# EAGLE design microBoard_main (EAGLE 6.2)

## Sheet 1 of 7: Project Environment
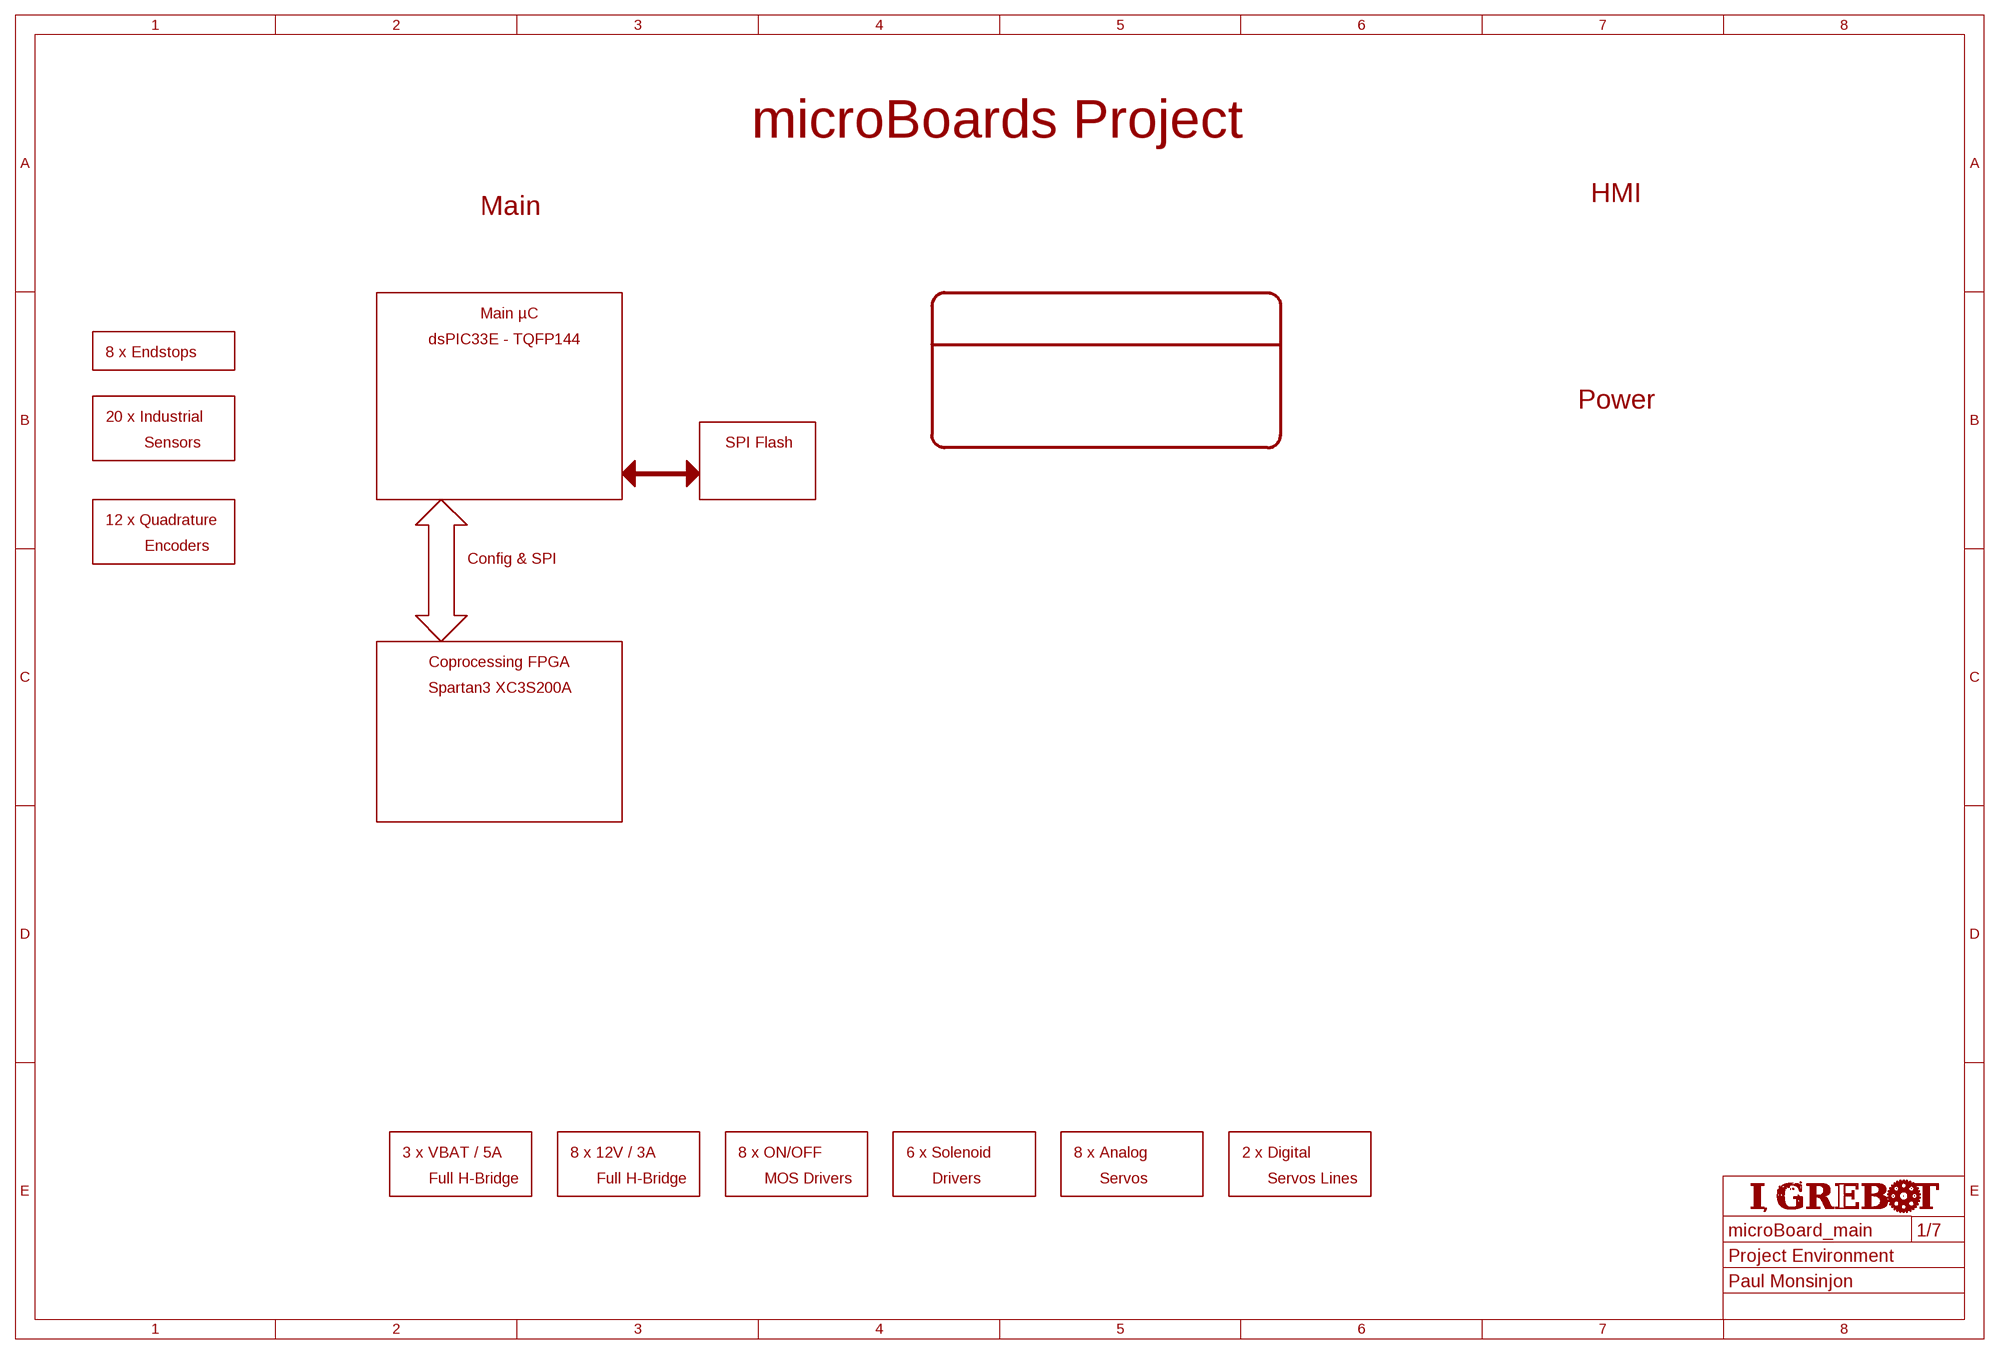
[diagram p0: schematic, sheet 1]
U$7 (FRAME_A3): AUTHOR: Paul Monsinjon; SHEET_NAME: Project Environment

### Notes on the sheet
- microBoards Project
- HMI
- Main
- Main µC
- dsPIC33E - TQFP144
- 8 x Endstops
- Power
- 20 x Industrial
- Sensors | SPI Flash
- 12 x Quadrature
- Encoders
- Config & SPI
- Coprocessing FPGA
- Spartan3 XC3S200A
- 3 x VBAT / 5A | 8 x 12V / 3A | 8 x ON/OFF | 6 x Solenoid | 8 x Analog | 2 x Digital
- Full H-Bridge | Full H-Bridge | MOS Drivers | Drivers | Servos | Servos Lines

## Sheet 2 of 7: Main µC dsPIC33E
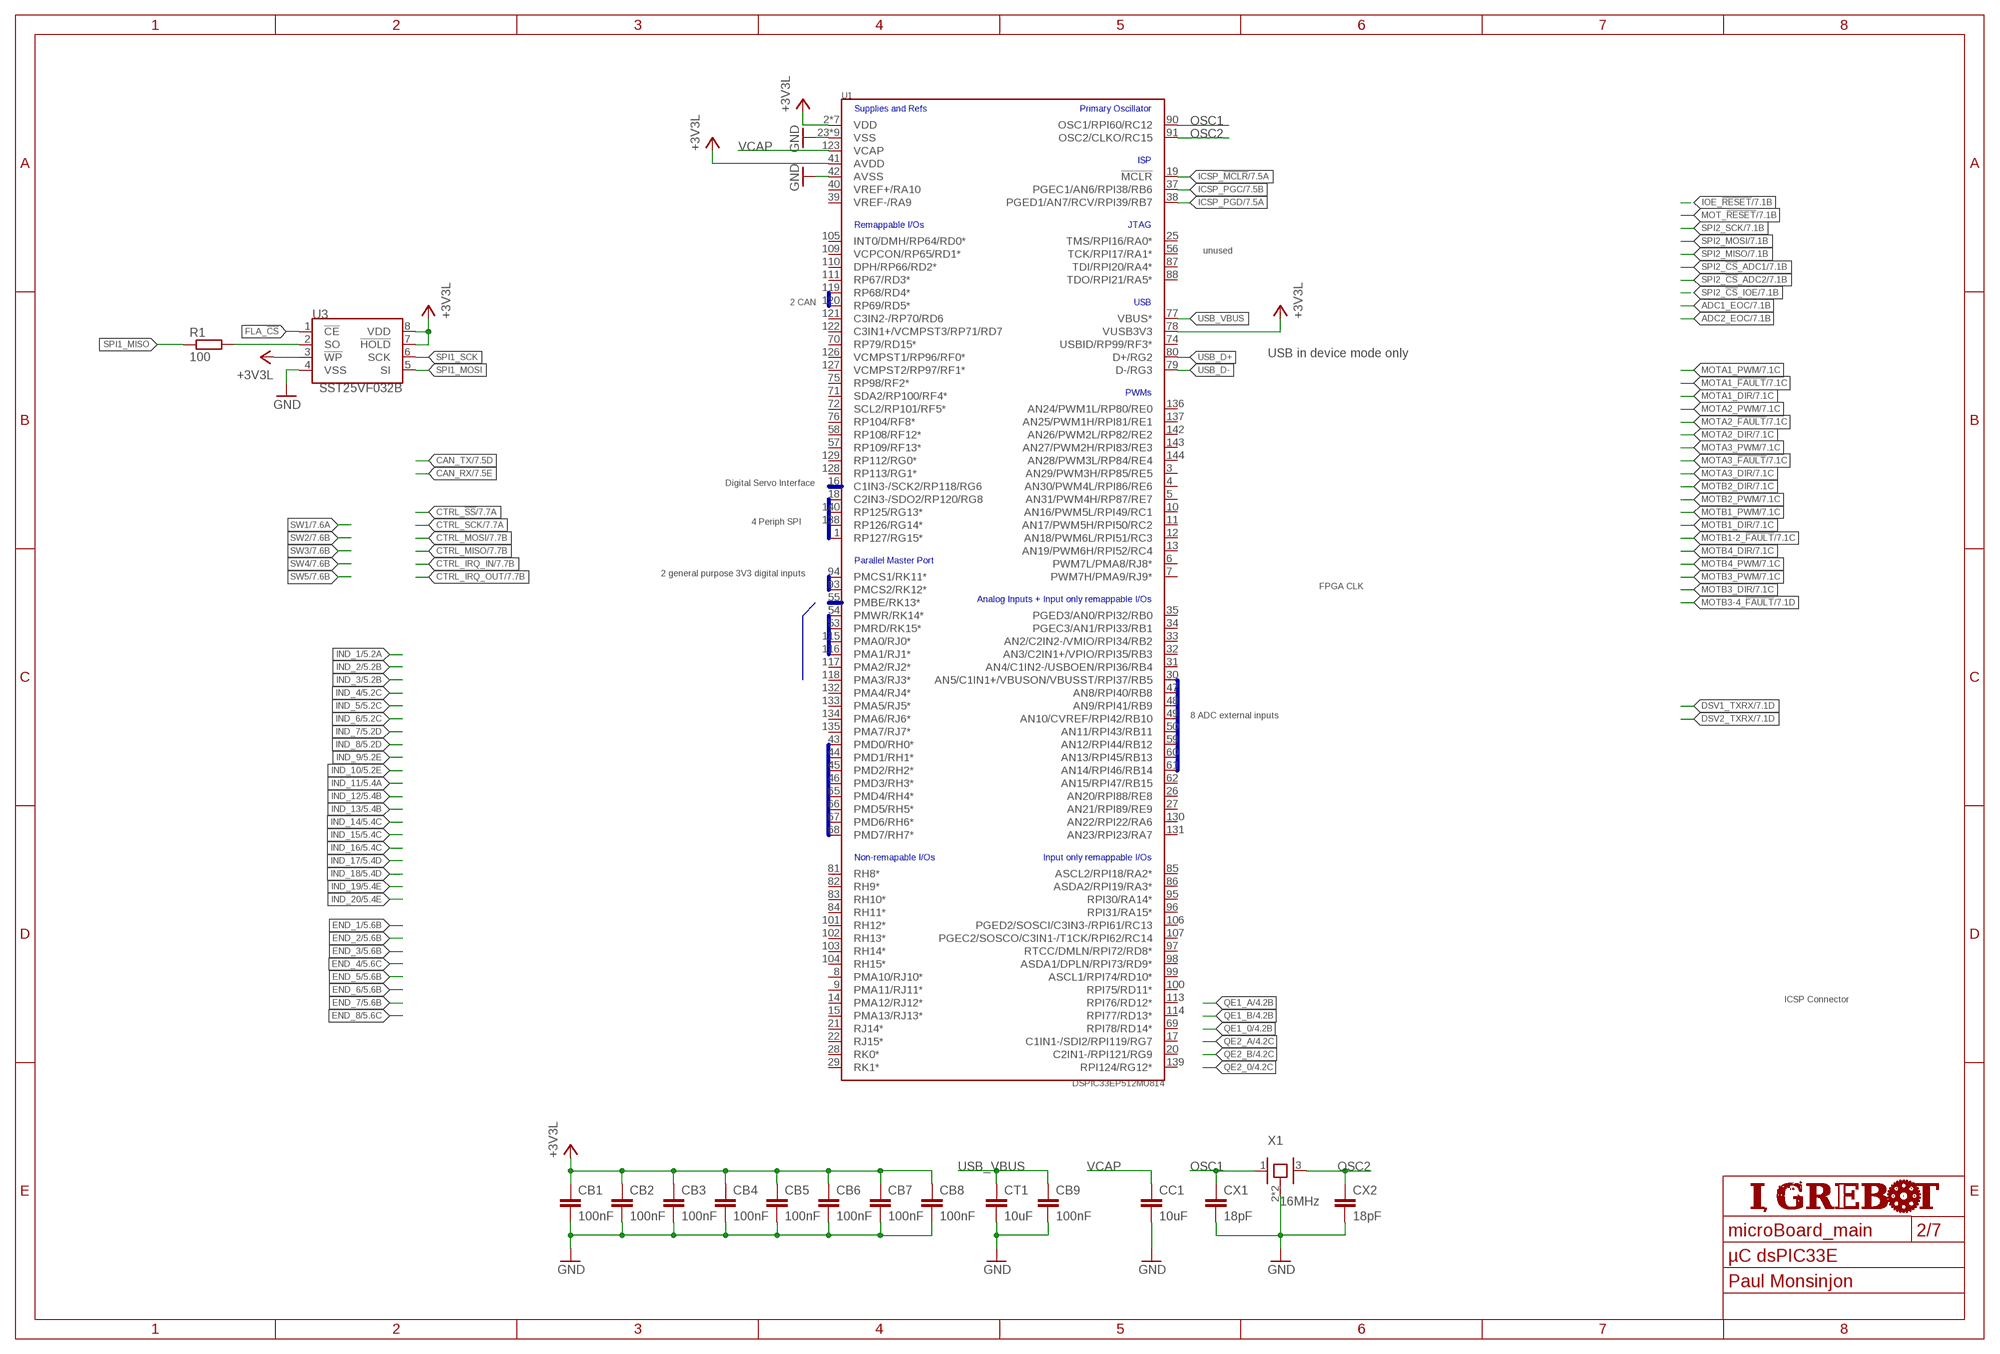
[diagram p1: schematic, sheet 2]
U$2 (FRAME_A3): AUTHOR: Paul Monsinjon; SHEET_NAME: µC dsPIC33E

### Parts
CB1  100nF  C-EUC0603  [C0603]
CB2  100nF  C-EUC0603  [C0603]
CB3  100nF  C-EUC0603  [C0603]
CB4  100nF  C-EUC0603  [C0603]
CB5  100nF  C-EUC0603  [C0603]
CB6  100nF  C-EUC0603  [C0603]
CB7  100nF  C-EUC0603  [C0603]
CB8  100nF  C-EUC0603  [C0603]
CB9  100nF  C-EUC0603  [C0603]
CC1  10uF  C-EUC1210  [C1210]
CT1  10uF  C-EUC1210  [C1210]
CX1  18pF  C-EUC0603  [C0603]
CX2  18pF  C-EUC0603  [C0603]
R1  100  R-EU_R0603  [R0603]
U1  DSPIC33EP512MU814  [TQFP_144]
U3  SST25VF032B  [SOIC_8]
X1  16MHz  XTAL_5X3  [CRYSTAL-OSC-SMD-5X3]

### Nets
+3V3L: CB1.1 CB2.1 CB3.1 CB4.1 CB5.1 CB6.1 CB7.1 CB8.1 U1.2(VDD) U1.24(VDD) U1.41(AVDD) U1.52(VDD) U1.64(VDD) U1.78(VUSB3V3) U1.89(VDD) U1.112(VDD) U1.124(VDD) U3.3(!WP!) U3.7(!HOLD!) U3.8(VDD) ; also sheet 3,4,5,6,7
FLA_!CS!: U3.1(!CE!)
GND: CB1.2 CB2.2 CB3.2 CB4.2 CB5.2 CB6.2 CB7.2 CB8.2 CB9.2 CC1.2 CT1.2 CX1.2 CX2.2 U1.23(VSS) U1.36(VSS) U1.42(AVSS) U1.51(VSS) U1.63(VSS) U1.73(VSS) U1.92(VSS) U1.108(VSS) U1.125(VSS) U1.141(VSS) U3.4(VSS) X1.2 X1.4 ; also sheet 3,4,5,6,7
ICSP_!MCLR!: U1.19(!MCLR!) ; also sheet 7
ICSP_PGC: U1.37(PGEC1/AN6/RPI38/RB6) ; also sheet 7
ICSP_PGD: U1.38(PGED1/AN7/RCV/RPI39/RB7) ; also sheet 7
N$2: R1.2 U3.2(SO)
OSC1: CX1.1 U1.90(OSC1/RPI60/RC12) X1.1
OSC2: CX2.1 U1.91(OSC2/CLKO/RC15) X1.3
SPI1_MISO: R1.1
SPI1_MOSI: U3.5(SI)
SPI1_SCK: U3.6(SCK)
USB_D+: U1.80(D+/RG2)
USB_D-: U1.79(D-/RG3)
USB_VBUS: CB9.1 CT1.1 U1.77(VBUS*)
VCAP: CC1.1 U1.123(VCAP)
Unconnected: U1.1(RP127/RG15*) U1.3(AN29/PWM3H/RP85/RE5) U1.4(AN30/PWM4L/RPI86/RE6) U1.5(AN31/PWM4H/RP87/RE7) U1.6(PWM7L/PMA8/RJ8*) U1.7(PWM7H/PMA9/RJ9*) U1.8(PMA10/RJ10*) U1.9(PMA11/RJ11*) U1.10(AN16/PWM5L/RPI49/RC1) U1.11(AN17/PWM5H/RPI50/RC2) U1.12(AN18/PWM6L/RPI51/RC3) U1.13(AN19/PWM6H/RPI52/RC4) U1.14(PMA12/RJ12*) U1.15(PMA13/RJ13*) U1.16(C1IN3-/SCK2/RP118/RG6) U1.17(C1IN1-/SDI2/RPI119/RG7) U1.18(C2IN3-/SDO2/RP120/RG8) U1.20(C2IN1-/RPI121/RG9) U1.21(RJ14*) U1.22(RJ15*) U1.25(TMS/RPI16/RA0*) U1.26(AN20/RPI88/RE8) U1.27(AN21/RPI89/RE9) U1.28(RK0*) U1.29(RK1*) U1.30(AN5/C1IN1+/VBUSON/VBUSST/RPI37/RB5) U1.31(AN4/C1IN2-/USBOEN/RPI36/RB4) U1.32(AN3/C2IN1+/VPIO/RPI35/RB3) U1.33(AN2/C2IN2-/VMIO/RPI34/RB2) U1.34(PGEC3/AN1/RPI33/RB1) U1.35(PGED3/AN0/RPI32/RB0) U1.39(VREF-/RA9) U1.40(VREF+/RA10) U1.43(PMD0/RH0*) U1.44(PMD1/RH1*) U1.45(PMD2/RH2*) U1.46(PMD3/RH3*) U1.47(AN8/RPI40/RB8) U1.48(AN9/RPI41/RB9) U1.49(AN10/CVREF/RPI42/RB10) U1.50(AN11/RPI43/RB11) U1.53(PMRD/RK15*) U1.54(PMWR/RK14*) U1.55(PMBE/RK13*) U1.56(TCK/RPI17/RA1*) U1.57(RP109/RF13*) U1.58(RP108/RF12*) U1.59(AN12/RPI44/RB12) U1.60(AN13/RPI45/RB13) U1.61(AN14/RPI46/RB14) U1.62(AN15/RPI47/RB15) U1.65(PMD4/RH4*) U1.66(PMD5/RH5*) U1.67(PMD6/RH6*) U1.68(PMD7/RH7*) U1.69(RPI78/RD14*) U1.70(RP79/RD15*) U1.71(SDA2/RP100/RF4*) U1.72(SCL2/RP101/RF5*) U1.74(USBID/RP99/RF3*) U1.75(RP98/RF2*) U1.76(RP104/RF8*) U1.81(RH8*) U1.82(RH9*) U1.83(RH10*) U1.84(RH11*) U1.85(ASCL2/RPI18/RA2*) U1.86(ASDA2/RPI19/RA3*) U1.87(TDI/RPI20/RA4*) U1.88(TDO/RPI21/RA5*) U1.93(PMCS2/RK12*) U1.94(PMCS1/RK11*) U1.95(RPI30/RA14*) U1.96(RPI31/RA15*) U1.97(RTCC/DMLN/RPI72/RD8*) U1.98(ASDA1/DPLN/RPI73/RD9*) U1.99(ASCL1/RPI74/RD10*) U1.100(RPI75/RD11*) U1.101(RH12*) U1.102(RH13*) U1.103(RH14*) U1.104(RH15*) U1.105(INT0/DMH/RP64/RD0*) U1.106(PGED2/SOSCI/C3IN3-/RPI61/RC13) U1.107(PGEC2/SOSCO/C3IN1-/T1CK/RPI62/RC14) U1.109(VCPCON/RP65/RD1*) U1.110(DPH/RP66/RD2*) U1.111(RP67/RD3*) U1.113(RPI76/RD12*) U1.114(RPI77/RD13*) U1.115(PMA0/RJ0*) U1.116(PMA1/RJ1*) U1.117(PMA2/RJ2*) U1.118(PMA3/RJ3*) U1.119(RP68/RD4*) U1.120(RP69/RD5*) U1.121(C3IN2-/RP70/RD6) U1.122(C3IN1+/VCMPST3/RP71/RD7) U1.126(VCMPST1/RP96/RF0*) U1.127(VCMPST2/RP97/RF1*) U1.128(RP113/RG1*) U1.129(RP112/RG0*) U1.130(AN22/RPI22/RA6) U1.131(AN23/RPI23/RA7) U1.132(PMA4/RJ4*) U1.133(PMA5/RJ5*) U1.134(PMA6/RJ6*) U1.135(PMA7/RJ7*) U1.136(AN24/PWM1L/RP80/RE0) U1.137(AN25/PWM1H/RPI81/RE1) U1.138(RP126/RG14*) U1.139(RPI124/RG12*) U1.140(RP125/RG13*) U1.142(AN26/PWM2L/RP82/RE2) U1.143(AN27/PWM2H/RPI83/RE3) U1.144(AN28/PWM3L/RP84/RE4)

### Buses
B$11
B$12
B$14
B$16
B$10
B$19
B$15
B$20
B$23

### Notes on the sheet
- unused
- 2 CAN
- USB in device mode only
- Digital Servo Interface
- 4 Periph SPI
- 2 general purpose 3V3 digital inputs
- FPGA CLK
- 8 ADC external inputs
- ICSP Connector

## Sheet 3 of 7: FPGA Spartan3
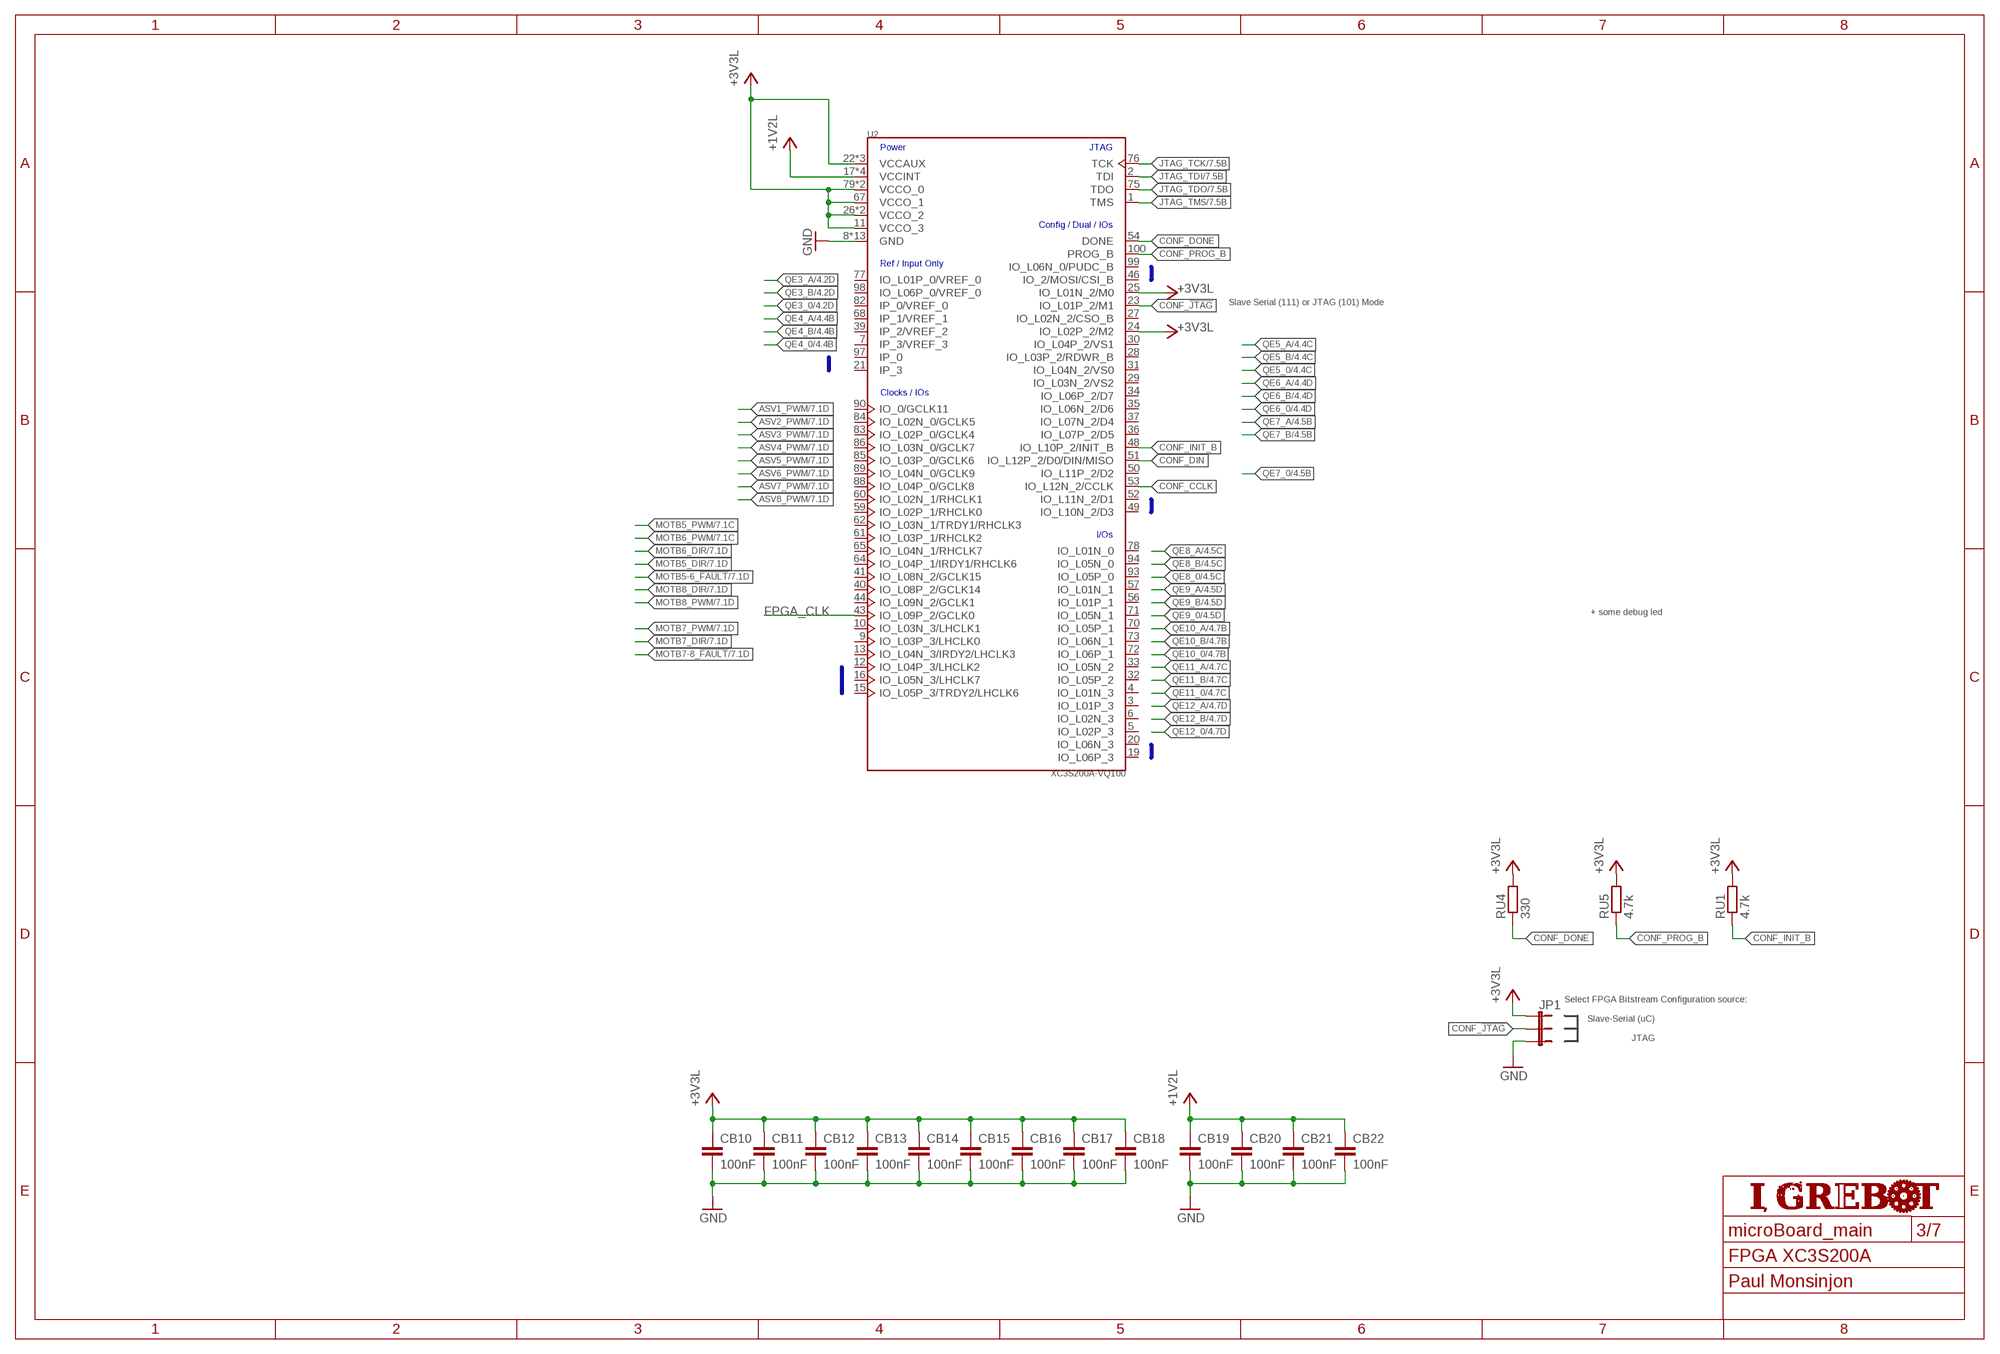
[diagram p2: schematic, sheet 3]
U$3 (FRAME_A3): AUTHOR: Paul Monsinjon; SHEET_NAME: FPGA XC3S200A

### Parts
CB10  100nF  C-EUC0603  [C0603]
CB11  100nF  C-EUC0603  [C0603]
CB12  100nF  C-EUC0603  [C0603]
CB13  100nF  C-EUC0603  [C0603]
CB14  100nF  C-EUC0603  [C0603]
CB15  100nF  C-EUC0603  [C0603]
CB16  100nF  C-EUC0603  [C0603]
CB17  100nF  C-EUC0603  [C0603]
CB18  100nF  C-EUC0603  [C0603]
CB19  100nF  C-EUC0603  [C0603]
CB20  100nF  C-EUC0603  [C0603]
CB21  100nF  C-EUC0603  [C0603]
CB22  100nF  C-EUC0603  [C0603]
JP1  JUMPER-3PTH  [1X03]
RU1  4.7k  R-EU_R0603  [R0603]
RU4  330  R-EU_R0603  [R0603]
RU5  4.7k  R-EU_R0603  [R0603]
U2  XC3S200A-VQ100  [VQFP_100]

### Nets
+1V2L: CB19.1 CB20.1 CB21.1 CB22.1 U2.17(VCCINT) U2.38(VCCINT) U2.66(VCCINT) U2.81(VCCINT) ; also sheet 7
+3V3L: CB10.1 CB11.1 CB12.1 CB13.1 CB14.1 CB15.1 CB16.1 CB17.1 CB18.1 JP1.1 RU1.2 RU4.2 RU5.2 U2.11(VCCO_3) U2.22(VCCAUX) U2.24(IO_L02P_2/M2) U2.25(IO_L01N_2/M0) U2.26(VCCO_2) U2.45(VCCO_2) U2.55(VCCAUX) U2.67(VCCO_1) U2.79(VCCO_0) U2.92(VCCAUX) U2.96(VCCO_0) ; also sheet 2,4,5,6,7
CONF_!JTAG!: JP1.2 U2.23(IO_L01P_2/M1)
CONF_CCLK: U2.53(IO_L12N_2/CCLK)
CONF_DIN: U2.51(IO_L12P_2/D0/DIN/MISO)
CONF_DONE: RU4.1 U2.54(DONE)
CONF_INIT_B: RU1.1 U2.48(IO_L10P_2/INIT_B)
CONF_PROG_B: RU5.1 U2.100(PROG_B)
FPGA_CLK: U2.43(IO_L09P_2/GCLK0)
GND: CB10.2 CB11.2 CB12.2 CB13.2 CB14.2 CB15.2 CB16.2 CB17.2 CB18.2 CB19.2 CB20.2 CB21.2 CB22.2 JP1.3 U2.8(GND) U2.14(GND) U2.18(GND) U2.42(GND) U2.47(GND) U2.58(GND) U2.63(GND) U2.69(GND) U2.74(GND) U2.80(GND) U2.87(GND) U2.91(GND) U2.95(GND) ; also sheet 2,4,5,6,7
JTAG_TCK: U2.76(TCK) ; also sheet 7
JTAG_TDI: U2.2(TDI) ; also sheet 7
JTAG_TDO: U2.75(TDO) ; also sheet 7
JTAG_TMS: U2.1(TMS) ; also sheet 7
Unconnected: U2.3(IO_L01P_3) U2.4(IO_L01N_3) U2.5(IO_L02P_3) U2.6(IO_L02N_3) U2.7(IP_3/VREF_3) U2.9(IO_L03P_3/LHCLK0) U2.10(IO_L03N_3/LHCLK1) U2.12(IO_L04P_3/LHCLK2) U2.13(IO_L04N_3/IRDY2/LHCLK3) U2.15(IO_L05P_3/TRDY2/LHCLK6) U2.16(IO_L05N_3/LHCLK7) U2.19(IO_L06P_3) U2.20(IO_L06N_3) U2.21(IP_3) U2.27(IO_L02N_2/CSO_B) U2.28(IO_L03P_2/RDWR_B) U2.29(IO_L03N_2/VS2) U2.30(IO_L04P_2/VS1) U2.31(IO_L04N_2/VS0) U2.32(IO_L05P_2) U2.33(IO_L05N_2) U2.34(IO_L06P_2/D7) U2.35(IO_L06N_2/D6) U2.36(IO_L07P_2/D5) U2.37(IO_L07N_2/D4) U2.39(IP_2/VREF_2) U2.40(IO_L08P_2/GCLK14) U2.41(IO_L08N_2/GCLK15) U2.44(IO_L09N_2/GCLK1) U2.46(IO_2/MOSI/CSI_B) U2.49(IO_L10N_2/D3) U2.50(IO_L11P_2/D2) U2.52(IO_L11N_2/D1) U2.56(IO_L01P_1) U2.57(IO_L01N_1) U2.59(IO_L02P_1/RHCLK0) U2.60(IO_L02N_1/RHCLK1) U2.61(IO_L03P_1/RHCLK2) U2.62(IO_L03N_1/TRDY1/RHCLK3) U2.64(IO_L04P_1/IRDY1/RHCLK6) U2.65(IO_L04N_1/RHCLK7) U2.68(IP_1/VREF_1) U2.70(IO_L05P_1) U2.71(IO_L05N_1) U2.72(IO_L06P_1) U2.73(IO_L06N_1) U2.77(IO_L01P_0/VREF_0) U2.78(IO_L01N_0) U2.82(IP_0/VREF_0) U2.83(IO_L02P_0/GCLK4) U2.84(IO_L02N_0/GCLK5) U2.85(IO_L03P_0/GCLK6) U2.86(IO_L03N_0/GCLK7) U2.88(IO_L04P_0/GCLK8) U2.89(IO_L04N_0/GCLK9) U2.90(IO_0/GCLK11) U2.93(IO_L05P_0) U2.94(IO_L05N_0) U2.97(IP_0) U2.98(IO_L06P_0/VREF_0) U2.99(IO_L06N_0/PUDC_B)

### Buses
B$1
B$2
B$4
B$6
B$17

### Notes on the sheet
- Slave Serial (111) or JTAG (101) Mode
- + some debug led
- Select FPGA Bitstream Configuration source:
- Slave-Serial (uC)
- JTAG

## Sheet 4 of 7: Quadrature Encoders Line Receivers
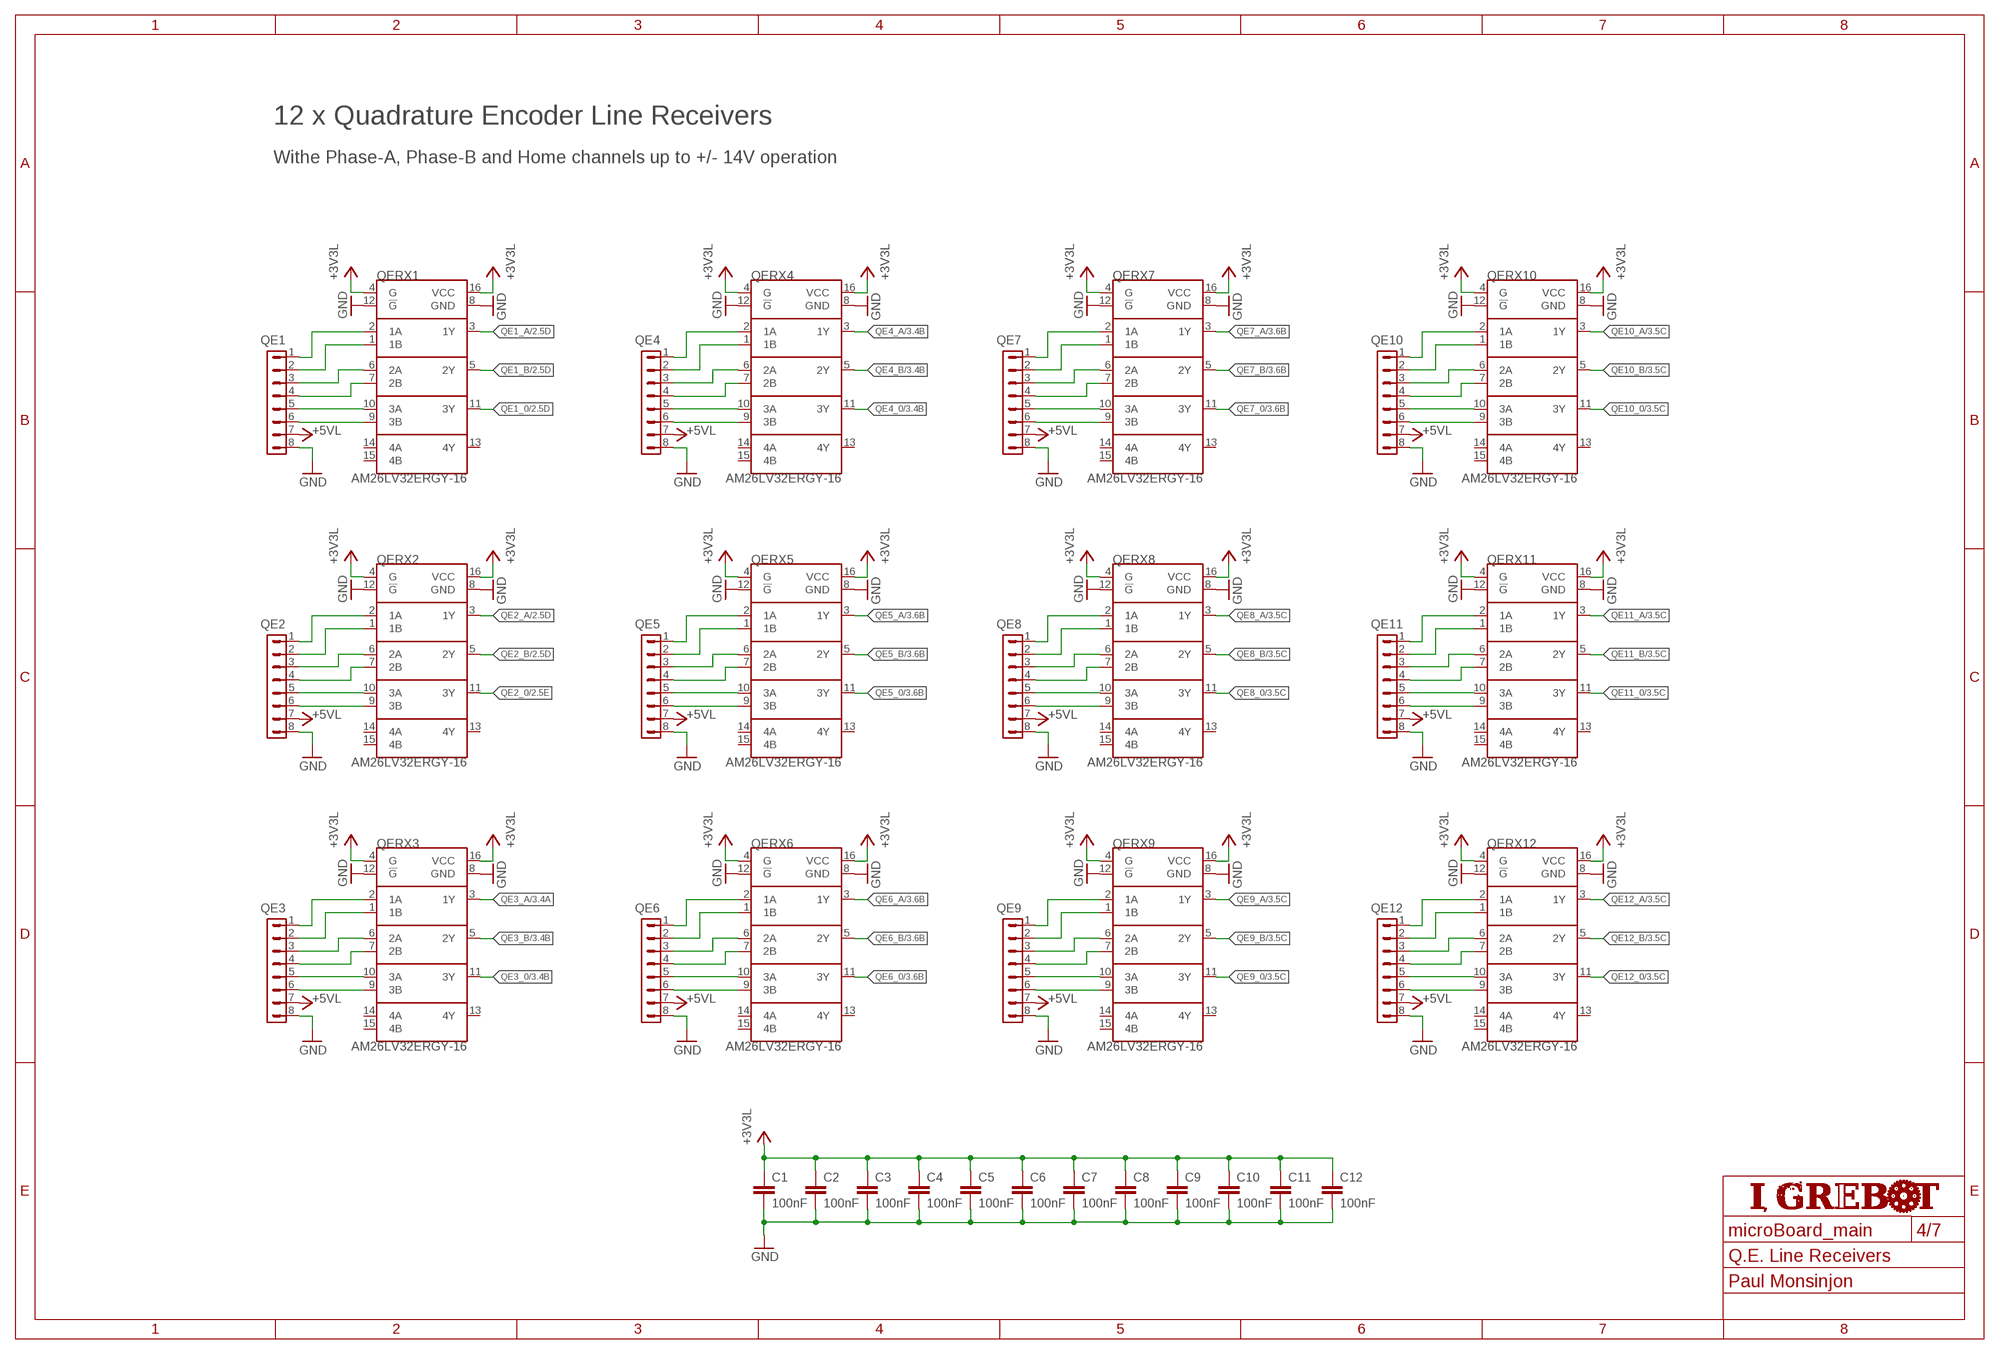
[diagram p3: schematic, sheet 4]
U$6 (FRAME_A3): AUTHOR: Paul Monsinjon; SHEET_NAME: Q.E. Line Receivers

### Parts
C1  100nF  C-EUC0603  [C0603]
C2  100nF  C-EUC0603  [C0603]
C3  100nF  C-EUC0603  [C0603]
C4  100nF  C-EUC0603  [C0603]
C5  100nF  C-EUC0603  [C0603]
C6  100nF  C-EUC0603  [C0603]
C7  100nF  C-EUC0603  [C0603]
C8  100nF  C-EUC0603  [C0603]
C9  100nF  C-EUC0603  [C0603]
C10  100nF  C-EUC0603  [C0603]
C11  100nF  C-EUC0603  [C0603]
C12  100nF  C-EUC0603  [C0603]
QE1  CON_1.27_8  [CON_1.27_8]
QE2  CON_1.27_8  [CON_1.27_8]
QE3  CON_1.27_8  [CON_1.27_8]
QE4  CON_1.27_8  [CON_1.27_8]
QE5  CON_1.27_8  [CON_1.27_8]
QE6  CON_1.27_8  [CON_1.27_8]
QE7  CON_1.27_8  [CON_1.27_8]
QE8  CON_1.27_8  [CON_1.27_8]
QE9  CON_1.27_8  [CON_1.27_8]
QE10  CON_1.27_8  [CON_1.27_8]
QE11  CON_1.27_8  [CON_1.27_8]
QE12  CON_1.27_8  [CON_1.27_8]
QERX1  AM26LV32ERGY-16  [RGY_16]
QERX2  AM26LV32ERGY-16  [RGY_16]
QERX3  AM26LV32ERGY-16  [RGY_16]
QERX4  AM26LV32ERGY-16  [RGY_16]
QERX5  AM26LV32ERGY-16  [RGY_16]
QERX6  AM26LV32ERGY-16  [RGY_16]
QERX7  AM26LV32ERGY-16  [RGY_16]
QERX8  AM26LV32ERGY-16  [RGY_16]
QERX9  AM26LV32ERGY-16  [RGY_16]
QERX10  AM26LV32ERGY-16  [RGY_16]
QERX11  AM26LV32ERGY-16  [RGY_16]
QERX12  AM26LV32ERGY-16  [RGY_16]

### Nets
+3V3L: C1.1 C2.1 C3.1 C4.1 C5.1 C6.1 QERX1.4(G) QERX1.16(VCC) QERX2.4(G) QERX2.16(VCC) QERX3.4(G) QERX3.16(VCC) QERX4.4(G) QERX4.16(VCC) QERX5.4(G) QERX5.16(VCC) QERX6.4(G) QERX6.16(VCC) QERX7.4(G) QERX7.16(VCC) QERX8.4(G) QERX8.16(VCC) QERX9.4(G) QERX9.16(VCC) QERX10.4(G) QERX10.16(VCC) QERX11.4(G) QERX11.16(VCC) QERX12.4(G) QERX12.16(VCC) ; also sheet 2,3,5,6,7
+3V3L1: C7.1 C8.1 C9.1 C10.1 C11.1 C12.1
+5VL: QE1.7 QE2.7 QE3.7 QE4.7 QE5.7 QE6.7 QE7.7 QE8.7 QE9.7 QE10.7 QE11.7 QE12.7 ; also sheet 7
GND: C1.2 C2.2 C3.2 C4.2 C5.2 C6.2 QE1.8 QE2.8 QE3.8 QE4.8 QE5.8 QE6.8 QE7.8 QE8.8 QE9.8 QE10.8 QE11.8 QE12.8 QERX1.8(GND) QERX1.12(!G!) QERX2.8(GND) QERX2.12(!G!) QERX3.8(GND) QERX3.12(!G!) QERX4.8(GND) QERX4.12(!G!) QERX5.8(GND) QERX5.12(!G!) QERX6.8(GND) QERX6.12(!G!) QERX7.8(GND) QERX7.12(!G!) QERX8.8(GND) QERX8.12(!G!) QERX9.8(GND) QERX9.12(!G!) QERX10.8(GND) QERX10.12(!G!) QERX11.8(GND) QERX11.12(!G!) QERX12.8(GND) QERX12.12(!G!) ; also sheet 2,3,5,6,7
GND1: C7.2 C8.2 C9.2 C10.2 C11.2 C12.2
N$1: QE1.4 QERX1.7(2B)
N$3: QE1.3 QERX1.6(2A)
N$4: QE1.5 QERX1.10(3A)
N$5: QE1.6 QERX1.9(3B)
N$6: QE1.2 QERX1.1(1B)
N$7: QE1.1 QERX1.2(1A)
N$8: QE2.5 QERX2.10(3A)
N$9: QE2.6 QERX2.9(3B)
N$10: QE2.2 QERX2.1(1B)
N$11: QE2.1 QERX2.2(1A)
N$12: QE2.4 QERX2.7(2B)
N$13: QE2.3 QERX2.6(2A)
N$14: QE3.5 QERX3.10(3A)
N$15: QE3.6 QERX3.9(3B)
N$16: QE3.2 QERX3.1(1B)
N$17: QE3.1 QERX3.2(1A)
N$18: QE3.4 QERX3.7(2B)
N$19: QE3.3 QERX3.6(2A)
N$21: QE4.5 QERX4.10(3A)
N$22: QE4.6 QERX4.9(3B)
N$23: QE4.2 QERX4.1(1B)
N$24: QE4.1 QERX4.2(1A)
N$25: QE4.4 QERX4.7(2B)
N$26: QE4.3 QERX4.6(2A)
N$27: QE5.5 QERX5.10(3A)
N$28: QE5.6 QERX5.9(3B)
N$29: QE5.2 QERX5.1(1B)
N$30: QE5.1 QERX5.2(1A)
N$31: QE5.4 QERX5.7(2B)
N$32: QE5.3 QERX5.6(2A)
N$33: QE6.5 QERX6.10(3A)
N$34: QE6.6 QERX6.9(3B)
N$35: QE6.2 QERX6.1(1B)
N$36: QE6.1 QERX6.2(1A)
N$37: QE6.4 QERX6.7(2B)
N$38: QE6.3 QERX6.6(2A)
N$39: QE7.5 QERX7.10(3A)
N$40: QE7.6 QERX7.9(3B)
N$41: QE7.2 QERX7.1(1B)
N$42: QE7.1 QERX7.2(1A)
N$43: QE7.4 QERX7.7(2B)
N$44: QE7.3 QERX7.6(2A)
N$45: QE8.5 QERX8.10(3A)
N$46: QE8.6 QERX8.9(3B)
N$47: QE8.2 QERX8.1(1B)
N$48: QE8.1 QERX8.2(1A)
N$49: QE8.4 QERX8.7(2B)
N$50: QE8.3 QERX8.6(2A)
N$51: QE9.5 QERX9.10(3A)
N$52: QE9.6 QERX9.9(3B)
N$53: QE9.2 QERX9.1(1B)
N$54: QE9.1 QERX9.2(1A)
N$55: QE9.4 QERX9.7(2B)
N$56: QE9.3 QERX9.6(2A)
N$57: QE10.5 QERX10.10(3A)
N$58: QE10.6 QERX10.9(3B)
N$59: QE10.2 QERX10.1(1B)
N$60: QE10.1 QERX10.2(1A)
N$61: QE10.4 QERX10.7(2B)
N$62: QE10.3 QERX10.6(2A)
N$63: QE11.5 QERX11.10(3A)
N$64: QE11.6 QERX11.9(3B)
N$65: QE11.2 QERX11.1(1B)
N$66: QE11.1 QERX11.2(1A)
N$67: QE11.4 QERX11.7(2B)
N$68: QE11.3 QERX11.6(2A)
N$69: QE12.5 QERX12.10(3A)
N$70: QE12.6 QERX12.9(3B)
N$71: QE12.2 QERX12.1(1B)
N$72: QE12.1 QERX12.2(1A)
N$73: QE12.4 QERX12.7(2B)
N$74: QE12.3 QERX12.6(2A)
QE1_0: QERX1.11(3Y) ; also sheet 2
QE1_A: QERX1.3(1Y) ; also sheet 2
QE1_B: QERX1.5(2Y) ; also sheet 2
QE2_0: QERX2.11(3Y) ; also sheet 2
QE2_A: QERX2.3(1Y) ; also sheet 2
QE2_B: QERX2.5(2Y) ; also sheet 2
QE3_0: QERX3.11(3Y) ; also sheet 3
QE3_A: QERX3.3(1Y) ; also sheet 3
QE3_B: QERX3.5(2Y) ; also sheet 3
QE4_0: QERX4.11(3Y) ; also sheet 3
QE4_A: QERX4.3(1Y) ; also sheet 3
QE4_B: QERX4.5(2Y) ; also sheet 3
QE5_0: QERX5.11(3Y) ; also sheet 3
QE5_A: QERX5.3(1Y) ; also sheet 3
QE5_B: QERX5.5(2Y) ; also sheet 3
QE6_0: QERX6.11(3Y) ; also sheet 3
QE6_A: QERX6.3(1Y) ; also sheet 3
QE6_B: QERX6.5(2Y) ; also sheet 3
QE7_0: QERX7.11(3Y) ; also sheet 3
QE7_A: QERX7.3(1Y) ; also sheet 3
QE7_B: QERX7.5(2Y) ; also sheet 3
QE8_0: QERX8.11(3Y) ; also sheet 3
QE8_A: QERX8.3(1Y) ; also sheet 3
QE8_B: QERX8.5(2Y) ; also sheet 3
QE9_0: QERX9.11(3Y) ; also sheet 3
QE9_A: QERX9.3(1Y) ; also sheet 3
QE9_B: QERX9.5(2Y) ; also sheet 3
QE10_0: QERX10.11(3Y) ; also sheet 3
QE10_A: QERX10.3(1Y) ; also sheet 3
QE10_B: QERX10.5(2Y) ; also sheet 3
QE11_0: QERX11.11(3Y) ; also sheet 3
QE11_A: QERX11.3(1Y) ; also sheet 3
QE11_B: QERX11.5(2Y) ; also sheet 3
QE12_0: QERX12.11(3Y) ; also sheet 3
QE12_A: QERX12.3(1Y) ; also sheet 3
QE12_B: QERX12.5(2Y) ; also sheet 3
Unconnected: QERX1.13(4Y) QERX1.14(4A) QERX1.15(4B) QERX2.13(4Y) QERX2.14(4A) QERX2.15(4B) QERX3.13(4Y) QERX3.14(4A) QERX3.15(4B) QERX4.13(4Y) QERX4.14(4A) QERX4.15(4B) QERX5.13(4Y) QERX5.14(4A) QERX5.15(4B) QERX6.13(4Y) QERX6.14(4A) QERX6.15(4B) QERX7.13(4Y) QERX7.14(4A) QERX7.15(4B) QERX8.13(4Y) QERX8.14(4A) QERX8.15(4B) QERX9.13(4Y) QERX9.14(4A) QERX9.15(4B) QERX10.13(4Y) QERX10.14(4A) QERX10.15(4B) QERX11.13(4Y) QERX11.14(4A) QERX11.15(4B) QERX12.13(4Y) QERX12.14(4A) QERX12.15(4B)

### Notes on the sheet
- 12 x Quadrature Encoder Line Receivers
- Withe Phase-A, Phase-B and Home channels up to +/- 14V operation

## Sheet 5 of 7: Sensors Interfaces
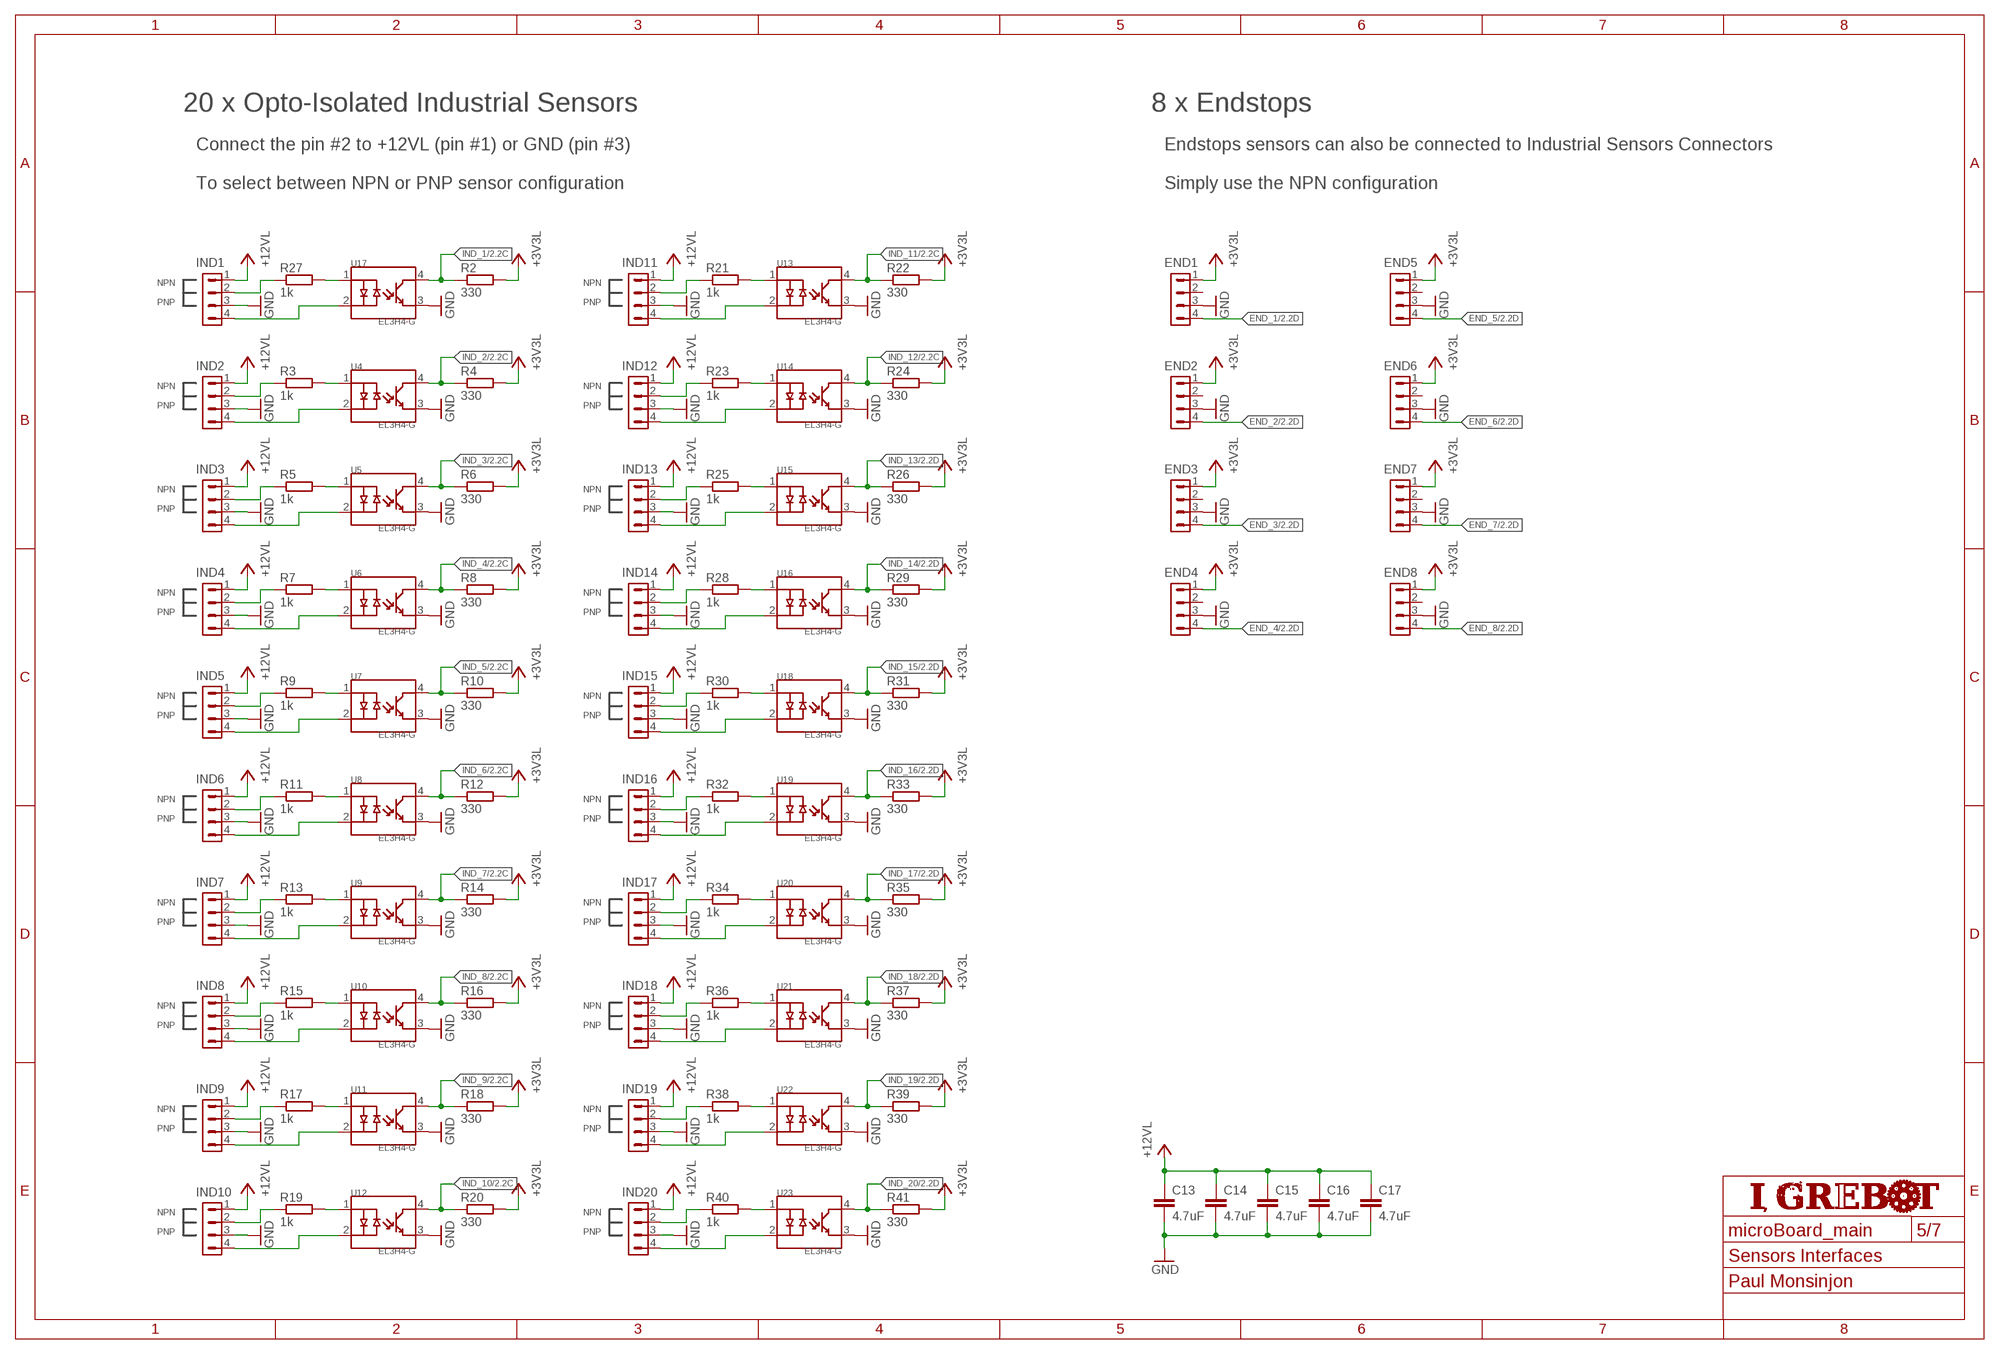
[diagram p4: schematic, sheet 5]
U$4 (FRAME_A3): AUTHOR: Paul Monsinjon; SHEET_NAME: Sensors Interfaces

### Parts
C13  4.7uF  C-EUC1206  [C1206]
C14  4.7uF  C-EUC1206  [C1206]
C15  4.7uF  C-EUC1206  [C1206]
C16  4.7uF  C-EUC1206  [C1206]
C17  4.7uF  C-EUC1206  [C1206]
END1  CON_1.27_4  [CON_1.27_4]
END2  CON_1.27_4  [CON_1.27_4]
END3  CON_1.27_4  [CON_1.27_4]
END4  CON_1.27_4  [CON_1.27_4]
END5  CON_1.27_4  [CON_1.27_4]
END6  CON_1.27_4  [CON_1.27_4]
END7  CON_1.27_4  [CON_1.27_4]
END8  CON_1.27_4  [CON_1.27_4]
IND1  CON_1.27_4  [CON_1.27_4]
IND2  CON_1.27_4  [CON_1.27_4]
IND3  CON_1.27_4  [CON_1.27_4]
IND4  CON_1.27_4  [CON_1.27_4]
IND5  CON_1.27_4  [CON_1.27_4]
IND6  CON_1.27_4  [CON_1.27_4]
IND7  CON_1.27_4  [CON_1.27_4]
IND8  CON_1.27_4  [CON_1.27_4]
IND9  CON_1.27_4  [CON_1.27_4]
IND10  CON_1.27_4  [CON_1.27_4]
IND11  CON_1.27_4  [CON_1.27_4]
IND12  CON_1.27_4  [CON_1.27_4]
IND13  CON_1.27_4  [CON_1.27_4]
IND14  CON_1.27_4  [CON_1.27_4]
IND15  CON_1.27_4  [CON_1.27_4]
IND16  CON_1.27_4  [CON_1.27_4]
IND17  CON_1.27_4  [CON_1.27_4]
IND18  CON_1.27_4  [CON_1.27_4]
IND19  CON_1.27_4  [CON_1.27_4]
IND20  CON_1.27_4  [CON_1.27_4]
R2  330  R-EU_R0603  [R0603]
R3  1k  R-EU_R0603  [R0603]
R4  330  R-EU_R0603  [R0603]
R5  1k  R-EU_R0603  [R0603]
R6  330  R-EU_R0603  [R0603]
R7  1k  R-EU_R0603  [R0603]
R8  330  R-EU_R0603  [R0603]
R9  1k  R-EU_R0603  [R0603]
R10  330  R-EU_R0603  [R0603]
R11  1k  R-EU_R0603  [R0603]
R12  330  R-EU_R0603  [R0603]
R13  1k  R-EU_R0603  [R0603]
R14  330  R-EU_R0603  [R0603]
R15  1k  R-EU_R0603  [R0603]
R16  330  R-EU_R0603  [R0603]
R17  1k  R-EU_R0603  [R0603]
R18  330  R-EU_R0603  [R0603]
R19  1k  R-EU_R0603  [R0603]
R20  330  R-EU_R0603  [R0603]
R21  1k  R-EU_R0603  [R0603]
R22  330  R-EU_R0603  [R0603]
R23  1k  R-EU_R0603  [R0603]
R24  330  R-EU_R0603  [R0603]
R25  1k  R-EU_R0603  [R0603]
R26  330  R-EU_R0603  [R0603]
R27  1k  R-EU_R0603  [R0603]
R28  1k  R-EU_R0603  [R0603]
R29  330  R-EU_R0603  [R0603]
R30  1k  R-EU_R0603  [R0603]
R31  330  R-EU_R0603  [R0603]
R32  1k  R-EU_R0603  [R0603]
R33  330  R-EU_R0603  [R0603]
R34  1k  R-EU_R0603  [R0603]
R35  330  R-EU_R0603  [R0603]
R36  1k  R-EU_R0603  [R0603]
R37  330  R-EU_R0603  [R0603]
R38  1k  R-EU_R0603  [R0603]
R39  330  R-EU_R0603  [R0603]
R40  1k  R-EU_R0603  [R0603]
R41  330  R-EU_R0603  [R0603]
U4  EL3H4-G  [SSOP_4]
U5  EL3H4-G  [SSOP_4]
U6  EL3H4-G  [SSOP_4]
U7  EL3H4-G  [SSOP_4]
U8  EL3H4-G  [SSOP_4]
U9  EL3H4-G  [SSOP_4]
U10  EL3H4-G  [SSOP_4]
U11  EL3H4-G  [SSOP_4]
U12  EL3H4-G  [SSOP_4]
U13  EL3H4-G  [SSOP_4]
U14  EL3H4-G  [SSOP_4]
U15  EL3H4-G  [SSOP_4]
U16  EL3H4-G  [SSOP_4]
U17  EL3H4-G  [SSOP_4]
U18  EL3H4-G  [SSOP_4]
U19  EL3H4-G  [SSOP_4]
U20  EL3H4-G  [SSOP_4]
U21  EL3H4-G  [SSOP_4]
U22  EL3H4-G  [SSOP_4]
U23  EL3H4-G  [SSOP_4]

### Nets
+3V3L: END1.1 END2.1 END3.1 END4.1 END5.1 END6.1 END7.1 END8.1 R2.2 R4.2 R6.2 R8.2 R10.2 R12.2 R14.2 R16.2 R18.2 R20.2 R22.2 R24.2 R26.2 R29.2 R31.2 R33.2 R35.2 R37.2 R39.2 R41.2 ; also sheet 2,3,4,6,7
+12VL: C13.1 C14.1 C15.1 C16.1 C17.1 IND1.1 IND2.1 IND3.1 IND4.1 IND5.1 IND6.1 IND7.1 IND8.1 IND9.1 IND10.1 IND11.1 IND12.1 IND13.1 IND14.1 IND15.1 IND16.1 IND17.1 IND18.1 IND19.1 IND20.1 ; also sheet 7
END_1: END1.4 ; also sheet 2
END_2: END2.4 ; also sheet 2
END_3: END3.4 ; also sheet 2
END_4: END4.4 ; also sheet 2
END_5: END5.4 ; also sheet 2
END_6: END6.4 ; also sheet 2
END_7: END7.4 ; also sheet 2
END_8: END8.4 ; also sheet 2
GND: C13.2 C14.2 C15.2 C16.2 C17.2 END1.3 END2.3 END3.3 END4.3 END5.3 END6.3 END7.3 END8.3 IND1.3 IND2.3 IND3.3 IND4.3 IND5.3 IND6.3 IND7.3 IND8.3 IND9.3 IND10.3 IND11.3 IND12.3 IND13.3 IND14.3 IND15.3 IND16.3 IND17.3 IND18.3 IND19.3 IND20.3 U4.3 U5.3 U6.3 U7.3 U8.3 U9.3 U10.3 U11.3 U12.3 U13.3 U14.3 U15.3 U16.3 U17.3 U18.3 U19.3 U20.3 U21.3 U22.3 U23.3 ; also sheet 2,3,4,6,7
IND_1: R2.1 U17.4 ; also sheet 2
IND_2: R4.1 U4.4 ; also sheet 2
IND_3: R6.1 U5.4 ; also sheet 2
IND_4: R8.1 U6.4 ; also sheet 2
IND_5: R10.1 U7.4 ; also sheet 2
IND_6: R12.1 U8.4 ; also sheet 2
IND_7: R14.1 U9.4 ; also sheet 2
IND_8: R16.1 U10.4 ; also sheet 2
IND_9: R18.1 U11.4 ; also sheet 2
IND_10: R20.1 U12.4 ; also sheet 2
IND_11: R22.1 U13.4 ; also sheet 2
IND_12: R24.1 U14.4 ; also sheet 2
IND_13: R26.1 U15.4 ; also sheet 2
IND_14: R29.1 U16.4 ; also sheet 2
IND_15: R31.1 U18.4 ; also sheet 2
IND_16: R33.1 U19.4 ; also sheet 2
IND_17: R35.1 U20.4 ; also sheet 2
IND_18: R37.1 U21.4 ; also sheet 2
IND_19: R39.1 U22.4 ; also sheet 2
IND_20: R41.1 U23.4 ; also sheet 2
N$20: IND1.4 U17.2
N$75: IND1.2 R27.1
N$76: R27.2 U17.1
N$77: IND2.2 R3.1
N$78: R3.2 U4.1
N$79: IND2.4 U4.2
N$80: IND3.2 R5.1
N$81: R5.2 U5.1
N$82: IND3.4 U5.2
N$83: IND4.2 R7.1
N$84: R7.2 U6.1
N$85: IND4.4 U6.2
N$86: IND5.2 R9.1
N$87: R9.2 U7.1
N$88: IND5.4 U7.2
N$89: IND6.2 R11.1
N$90: R11.2 U8.1
N$91: IND6.4 U8.2
N$92: IND7.2 R13.1
N$93: R13.2 U9.1
N$94: IND7.4 U9.2
N$95: IND8.2 R15.1
N$96: R15.2 U10.1
N$97: IND8.4 U10.2
N$98: IND9.2 R17.1
N$99: R17.2 U11.1
N$100: IND9.4 U11.2
N$101: IND10.2 R19.1
N$102: R19.2 U12.1
N$103: IND10.4 U12.2
N$104: IND11.2 R21.1
N$105: R21.2 U13.1
N$106: IND11.4 U13.2
N$107: IND12.2 R23.1
N$108: R23.2 U14.1
N$109: IND12.4 U14.2
N$110: IND13.2 R25.1
N$111: R25.2 U15.1
N$112: IND13.4 U15.2
N$113: IND14.2 R28.1
N$114: R28.2 U16.1
N$115: IND14.4 U16.2
N$116: IND15.2 R30.1
N$117: R30.2 U18.1
N$118: IND15.4 U18.2
N$119: IND16.2 R32.1
N$120: R32.2 U19.1
N$121: IND16.4 U19.2
N$122: IND17.2 R34.1
N$123: R34.2 U20.1
N$124: IND17.4 U20.2
N$125: IND18.2 R36.1
N$126: R36.2 U21.1
N$127: IND18.4 U21.2
N$128: IND19.2 R38.1
N$129: R38.2 U22.1
N$130: IND19.4 U22.2
N$131: IND20.2 R40.1
N$132: R40.2 U23.1
N$133: IND20.4 U23.2
Unconnected: END1.2 END2.2 END3.2 END4.2 END5.2 END6.2 END7.2 END8.2

### Notes on the sheet
- 20 x Opto-Isolated Industrial Sensors | 8 x Endstops
- Connect the pin #2 to +12VL (pin #1) or GND (pin #3) | Endstops sensors can also be connected to Industrial Sensors Connectors
- To select between NPN or PNP sensor configuration | Simply use the NPN configuration
- NPN | NPN
- PNP | PNP
- NPN | NPN
- PNP | PNP
- NPN | NPN
- PNP | PNP
- NPN | NPN
- PNP | PNP
- NPN | NPN
- PNP | PNP
- NPN | NPN
- PNP | PNP
- NPN | NPN
- PNP | PNP
- NPN | NPN
- PNP | PNP
- NPN | NPN
- PNP | PNP
- NPN | NPN
- PNP | PNP

## Sheet 6 of 7: WiFi module
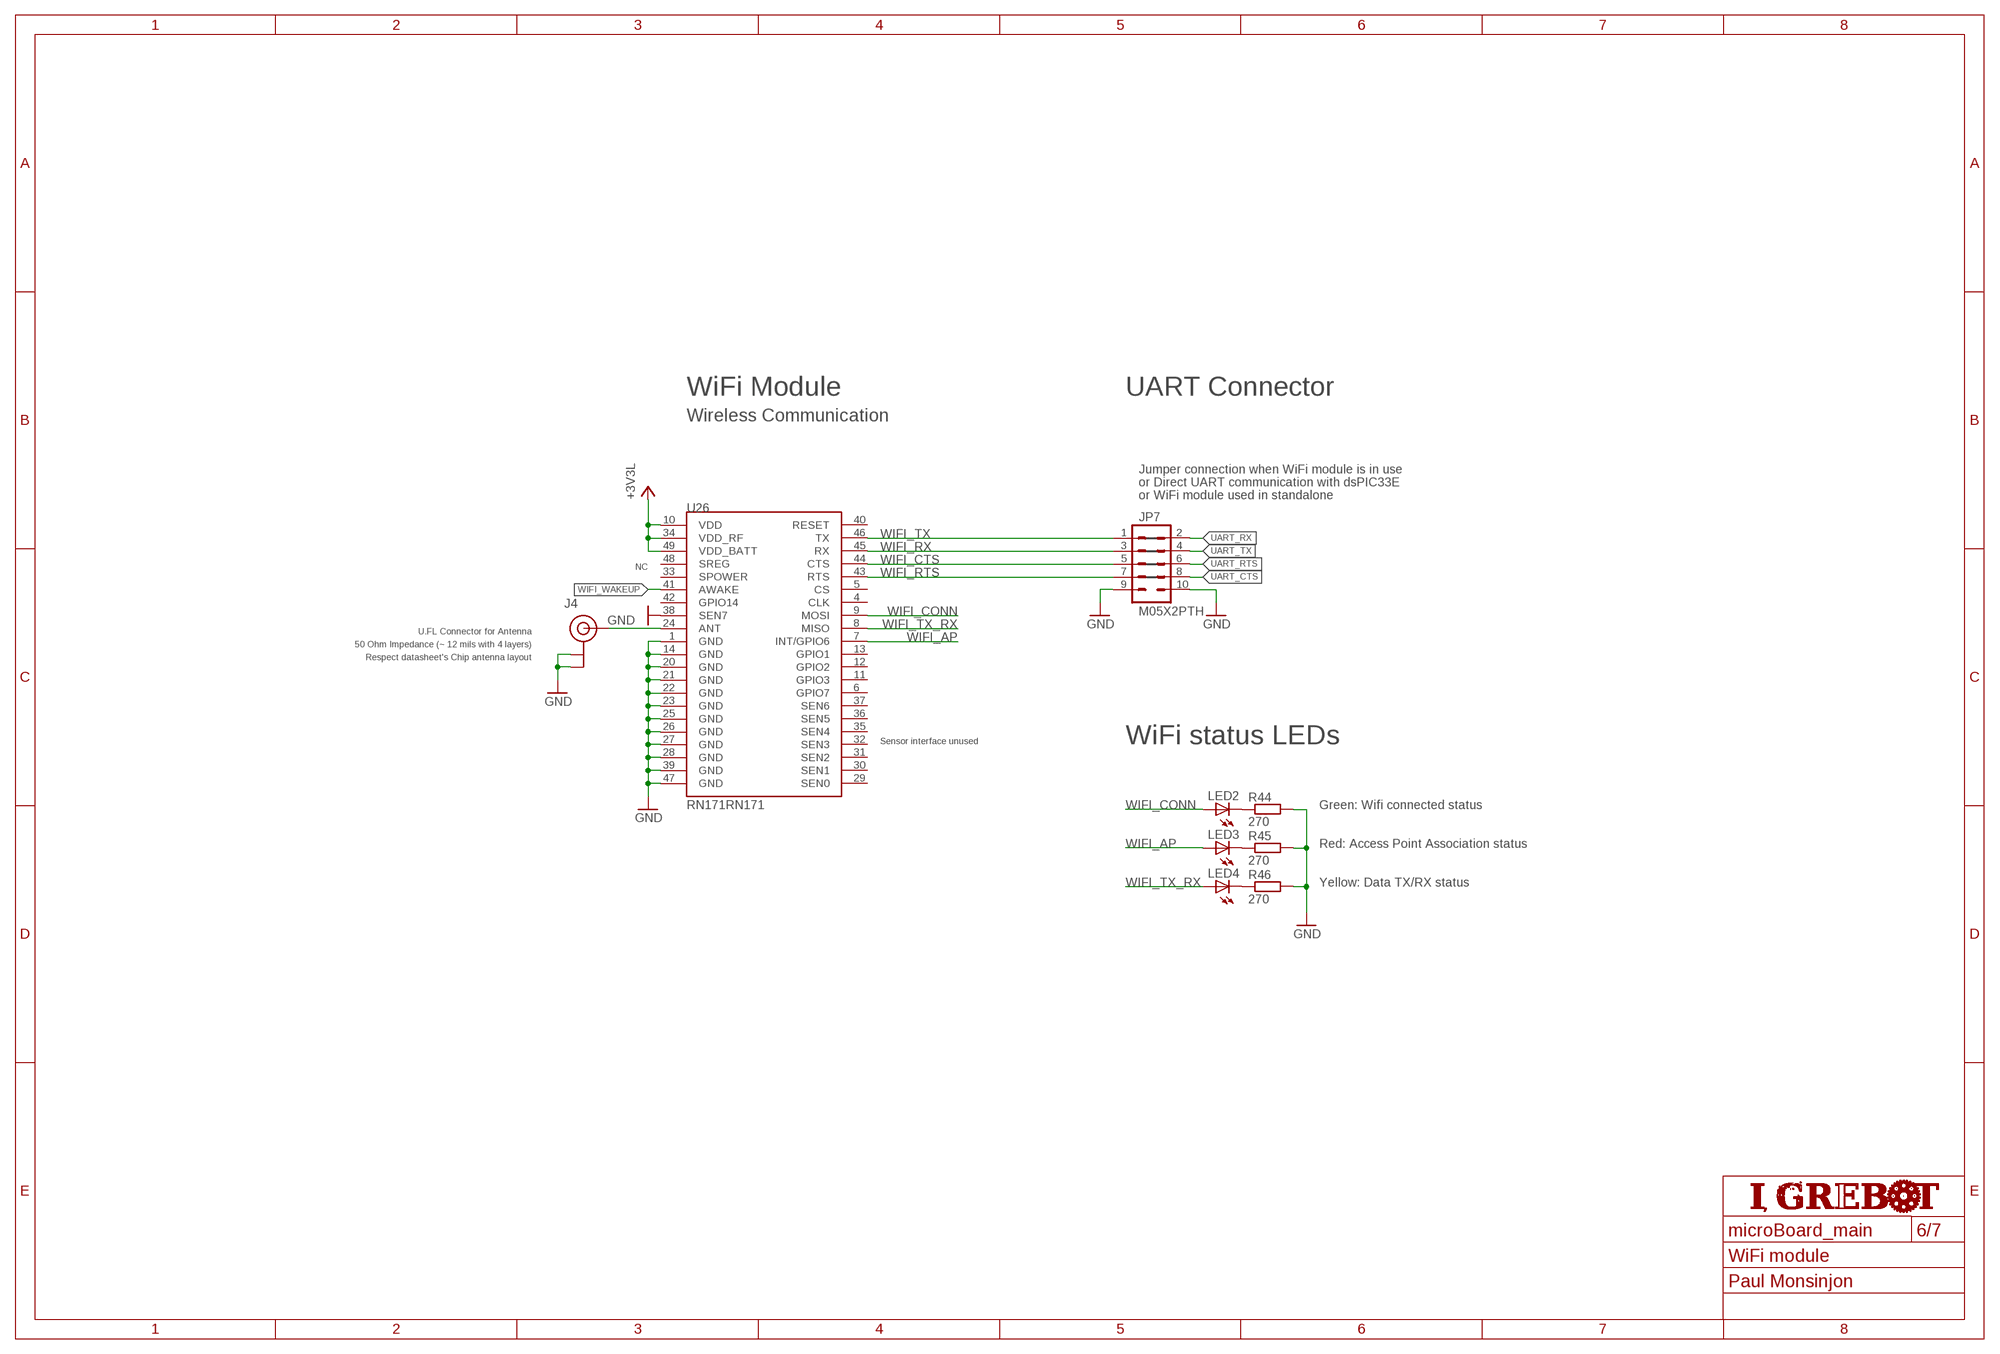
[diagram p5: schematic, sheet 6]
U$29 (FRAME_A3): AUTHOR: Paul Monsinjon; SHEET_NAME: WiFi module

### Parts
J4  U.FL  [U.FL]
JP7  M05X2PTH  [AVR_ICSP]
LED2  LEDCHIP-LED0805  [CHIP-LED0805]
LED3  LEDCHIP-LED0805  [CHIP-LED0805]
LED4  LEDCHIP-LED0805  [CHIP-LED0805]
R44  270  R-EU_R0603  [R0603]
R45  270  R-EU_R0603  [R0603]
R46  270  R-EU_R0603  [R0603]
U26  RN171RN171  [RN171]

### Nets
+3V3L: U26.10(VDD) U26.34(VDD_RF) U26.49(VDD_BATT) ; also sheet 2,3,4,5,7
GND: J4.P$1(GND) J4.P$2(GND) JP7.9 JP7.10 R44.2 R45.2 R46.2 U26.1(GND) U26.14(GND) U26.20(GND) U26.21(GND) U26.22(GND) U26.23(GND) U26.25(GND) U26.26(GND) U26.27(GND) U26.28(GND) U26.38(SEN7) U26.39(GND) U26.47(GND) ; also sheet 2,3,4,5,7
N$140: LED2.C R44.1
N$141: LED3.C R45.1
N$142: LED4.C R46.1
N$143: J4.P$3(SIGNAL) U26.24(ANT)
UART_CTS: JP7.8
UART_RTS: JP7.6
UART_RX: JP7.2
UART_TX: JP7.4
WIFI_AP: LED3.A U26.7(INT/GPIO6)
WIFI_CONN: LED2.A U26.9(MOSI)
WIFI_CTS: JP7.5 U26.44(CTS)
WIFI_RTS: JP7.7 U26.43(RTS)
WIFI_RX: JP7.3 U26.45(RX)
WIFI_TX: JP7.1 U26.46(TX)
WIFI_TX_RX: LED4.A U26.8(MISO)
WIFI_WAKEUP: U26.41(AWAKE)
Unconnected: U26.4(CLK) U26.5(CS) U26.6(GPIO7) U26.11(GPIO3) U26.12(GPIO2) U26.13(GPIO1) U26.29(SEN0) U26.30(SEN1) U26.31(SEN2) U26.32(SEN3) U26.33(SPOWER) U26.35(SEN4) U26.36(SEN5) U26.37(SEN6) U26.40(RESET) U26.42(GPIO14) U26.48(SREG)

### Notes on the sheet
- WiFi Module | UART Connector
- Wireless Communication
- Jumper connection when WiFi module is in use
- or Direct UART communication with dsPIC33E
- or WiFi module used in standalone
- NC
- U.FL Connector for Antenna
- 50 Ohm Impedance (~ 12 mils with 4 layers)
- Respect datasheet's Chip antenna layout
- Sensor interface unused | WiFi status LEDs
- Green: Wifi connected status
- Red: Access Point Association status
- Yellow: Data TX/RX status

## Sheet 7 of 7: Power, HMI & Other Interfaces
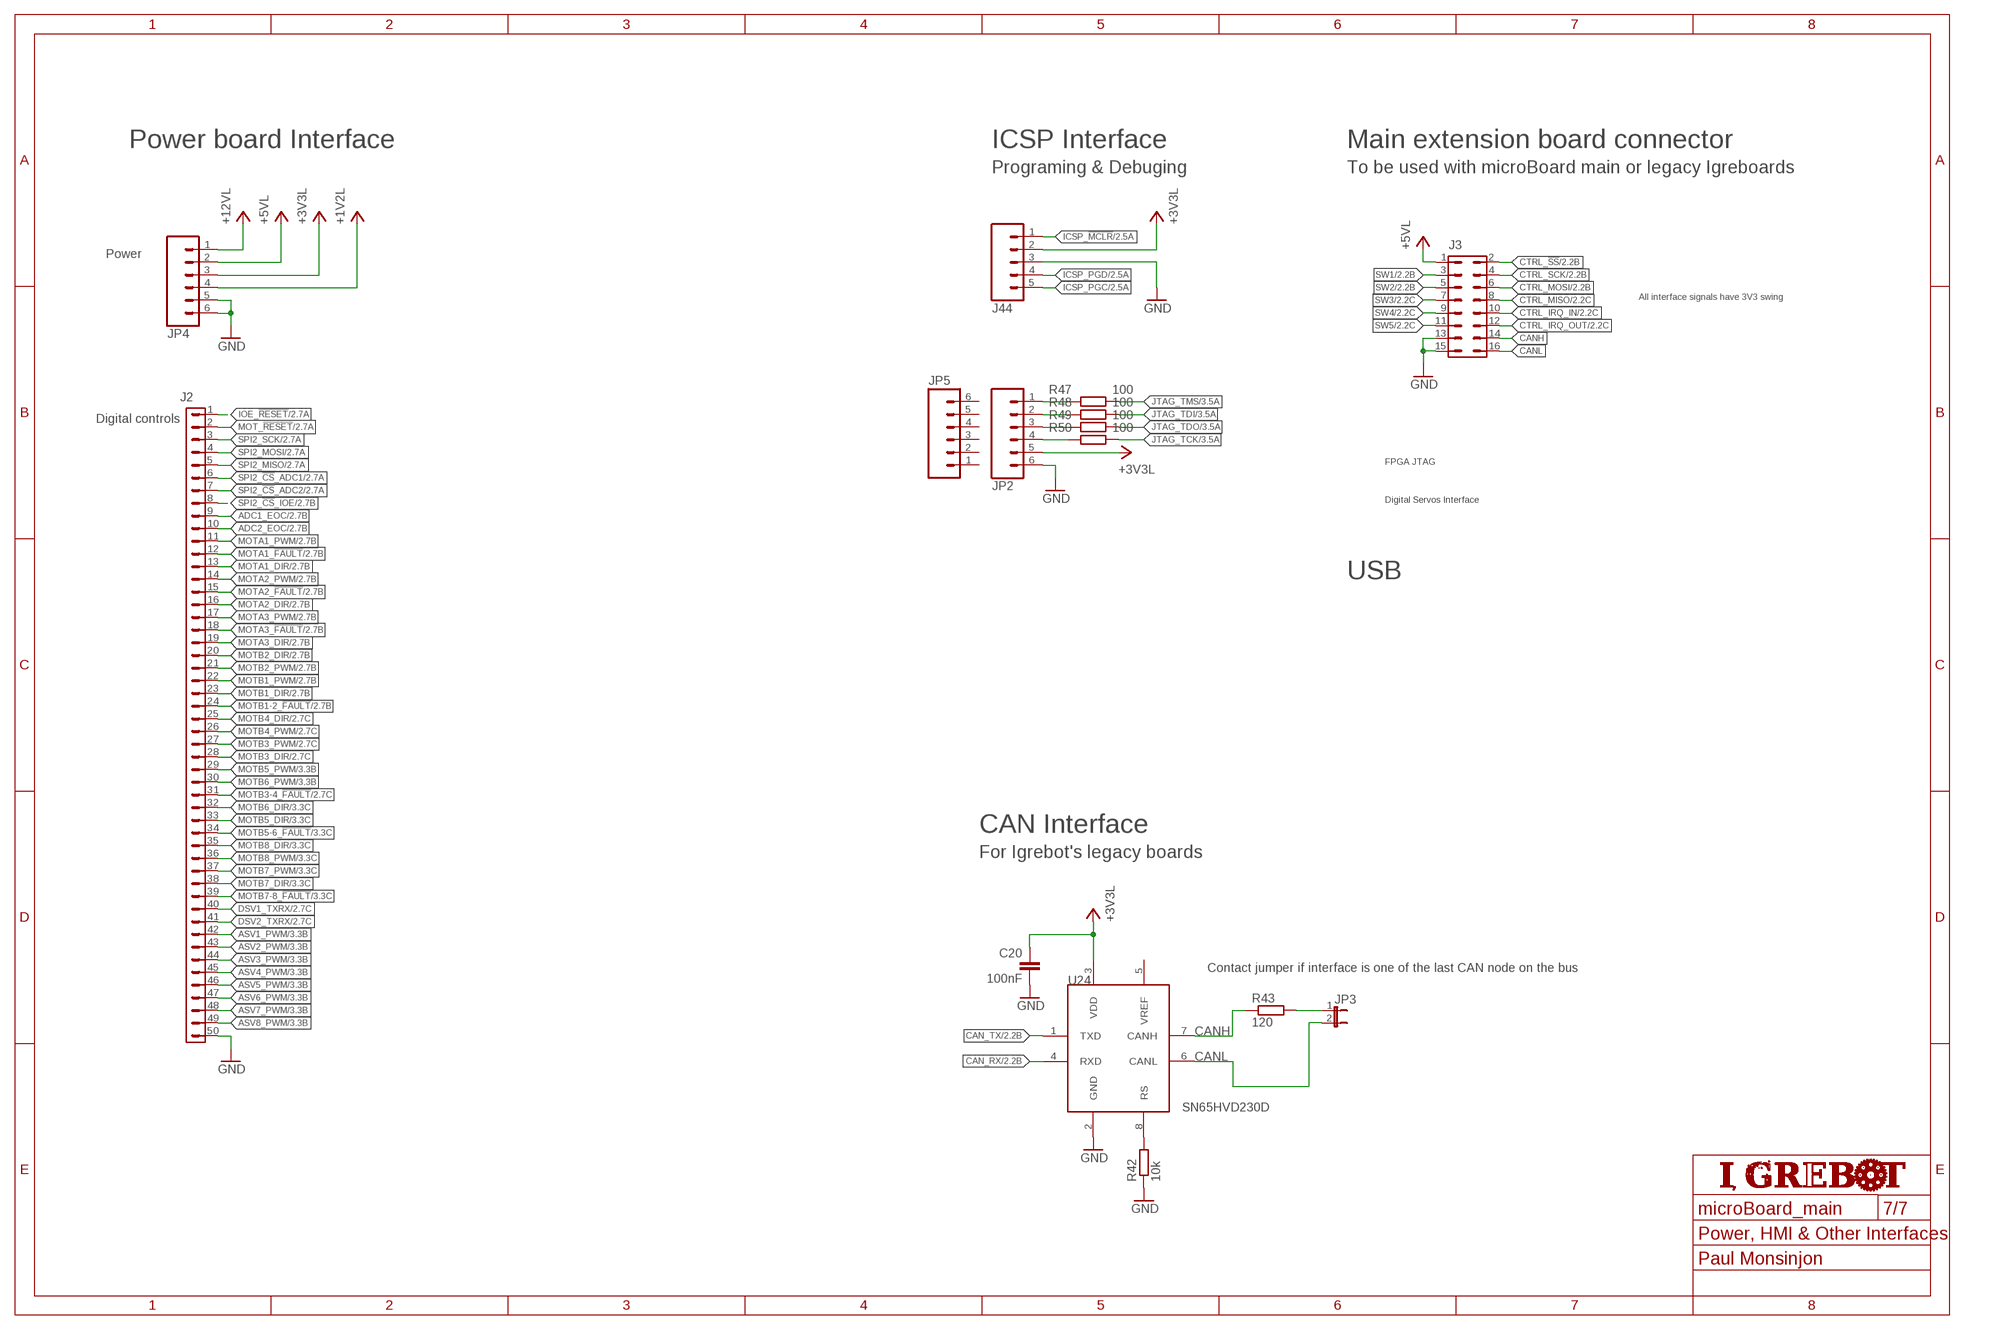
[diagram p6: schematic, sheet 7]
U$1 (FRAME_A3): AUTHOR: Paul Monsinjon; SHEET_NAME: Power, HMI & Other Interfaces

### Parts
C20  100nF  C-EUC0603  [C0603]
J2  FFC-0.5_50  [FFC-SMD-0.5_50]
J3  HE10_H_16  [CON_2X_2.54_H_16]
J44  M05LOCK  [1X05_LOCK]
JP2  M06LOCK  [1X06_LOCK]
JP3  JUMPER-2PTH_LOCK  [1X02_LOCK]
JP4  M06LOCK  [1X06_LOCK]
JP5  M06SMD-1MM  [1X06-1MM]
R42  10k  R-EU_R0603  [R0603]
R43  120  R-EU_R0603  [R0603]
R47  100  R-EU_R0603  [R0603]
R48  100  R-EU_R0603  [R0603]
R49  100  R-EU_R0603  [R0603]
R50  100  R-EU_R0603  [R0603]
U24  SN65HVD230D  MCP2551  [SO-08]

### Nets
+1V2L: JP4.4 ; also sheet 3
+3V3L: C20.1 J44.2 JP2.5 JP4.3 U24.3(VDD) ; also sheet 2,3,4,5,6
+5VL: J3.1 JP4.2 ; also sheet 4
+12VL: JP4.1 ; also sheet 5
ADC1_EOC: J2.9 ; also sheet 2
ADC2_EOC: J2.10 ; also sheet 2
ASV1_PWM: J2.42 ; also sheet 3
ASV2_PWM: J2.43 ; also sheet 3
ASV3_PWM: J2.44 ; also sheet 3
ASV4_PWM: J2.45 ; also sheet 3
ASV5_PWM: J2.46 ; also sheet 3
ASV6_PWM: J2.47 ; also sheet 3
ASV7_PWM: J2.48 ; also sheet 3
ASV8_PWM: J2.49 ; also sheet 3
CAN_RX: U24.4(RXD) ; also sheet 2
CAN_TX: U24.1(TXD) ; also sheet 2
CANH: J3.14 R43.1 U24.7(CANH)
CANL: J3.16 JP3.2 U24.6(CANL)
CTRL_!SS!: J3.2 ; also sheet 2
CTRL_IRQ_IN: J3.10 ; also sheet 2
CTRL_IRQ_OUT: J3.12 ; also sheet 2
CTRL_MISO: J3.8 ; also sheet 2
CTRL_MOSI: J3.6 ; also sheet 2
CTRL_SCK: J3.4 ; also sheet 2
DSV1_TXRX: J2.40 ; also sheet 2
DSV2_TXRX: J2.41 ; also sheet 2
GND: C20.2 J2.50 J3.13 J3.15 J44.3 JP2.6 JP4.5 JP4.6 R42.1 U24.2(GND) ; also sheet 2,3,4,5,6
ICSP_!MCLR!: J44.1 ; also sheet 2
ICSP_PGC: J44.5 ; also sheet 2
ICSP_PGD: J44.4 ; also sheet 2
IOE_!RESET!: J2.1 ; also sheet 2
JTAG_TCK: R50.2 ; also sheet 3
JTAG_TDI: R48.2 ; also sheet 3
JTAG_TDO: R49.2 ; also sheet 3
JTAG_TMS: R47.2 ; also sheet 3
MOT_!RESET!: J2.2 ; also sheet 2
MOTA1_!FAULT!: J2.12 ; also sheet 2
MOTA1_DIR: J2.13 ; also sheet 2
MOTA1_PWM: J2.11 ; also sheet 2
MOTA2_!FAULT!: J2.15 ; also sheet 2
MOTA2_DIR: J2.16 ; also sheet 2
MOTA2_PWM: J2.14 ; also sheet 2
MOTA3_!FAULT!: J2.18 ; also sheet 2
MOTA3_DIR: J2.19 ; also sheet 2
MOTA3_PWM: J2.17 ; also sheet 2
MOTB1-2_!FAULT!: J2.24 ; also sheet 2
MOTB1_DIR: J2.23 ; also sheet 2
MOTB1_PWM: J2.22 ; also sheet 2
MOTB2_DIR: J2.20 ; also sheet 2
MOTB2_PWM: J2.21 ; also sheet 2
MOTB3-4_!FAULT!: J2.31 ; also sheet 2
MOTB3_DIR: J2.28 ; also sheet 2
MOTB3_PWM: J2.27 ; also sheet 2
MOTB4_DIR: J2.25 ; also sheet 2
MOTB4_PWM: J2.26 ; also sheet 2
MOTB5-6_!FAULT!: J2.34 ; also sheet 3
MOTB5_DIR: J2.33 ; also sheet 3
MOTB5_PWM: J2.29 ; also sheet 3
MOTB6_DIR: J2.32 ; also sheet 3
MOTB6_PWM: J2.30 ; also sheet 3
MOTB7-8_!FAULT!: J2.39 ; also sheet 3
MOTB7_DIR: J2.38 ; also sheet 3
MOTB7_PWM: J2.37 ; also sheet 3
MOTB8_DIR: J2.35 ; also sheet 3
MOTB8_PWM: J2.36 ; also sheet 3
N$134: R42.2 U24.8(RS)
N$135: JP3.1 R43.2
N$136: JP2.2 R48.1
N$137: JP2.1 R47.1
N$138: JP2.3 R49.1
N$139: JP2.4 R50.1
SPI2_!CS!_ADC1: J2.6 ; also sheet 2
SPI2_!CS!_ADC2: J2.7 ; also sheet 2
SPI2_!CS!_IOE: J2.8 ; also sheet 2
SPI2_MISO: J2.5 ; also sheet 2
SPI2_MOSI: J2.4 ; also sheet 2
SPI2_SCK: J2.3 ; also sheet 2
SW1: J3.3 ; also sheet 2
SW2: J3.5 ; also sheet 2
SW3: J3.7 ; also sheet 2
SW4: J3.9 ; also sheet 2
SW5: J3.11 ; also sheet 2
Unconnected: JP5.1 JP5.2 JP5.3 JP5.4 JP5.5 JP5.6 U24.5(VREF)

### Notes on the sheet
- Power board Interface | ICSP Interface | Main extension board connector
- Programing & Debuging | To be used with microBoard main or legacy Igreboards
- Power
- All interface signals have 3V3 swing
- Digital controls
- FPGA JTAG
- Digital Servos Interface
- USB
- CAN Interface
- For Igrebot's legacy boards
- Contact jumper if interface is one of the last CAN node on the bus

## Library data of the parts
C1-C12 C20 CB1-CB22 CC1 CT1 CX1 CX2 = rcl:C-EU: CAPACITOR, European symbol
C13-C17 = resistor:C-EU: CAPACITOR, European symbol
END1-END8 IND1-IND20 = microLib:CON_1.27_4
J2 = microLib:FFC-0.5_50
J3 = microLib:HE10_H_16
J4 = SparkFun-Connectors:U.FL: SMD antenna connector- WRL-09144; PROD_ID: CONN-09193
J44 = SparkFun-Connectors:M05: Header 5 Standard 5-pin 0.1" header. Use with straight break away headers (SKU : PRT-00116), right angle break away headers (PRT-00553), swiss pins (PRT-00743), machine pins (PRT-00117), and female headers (PRT-00115). Molex polarized connector foot print use with SKU : PRT-08230 with associated crimp pins and housings.
JP1 = SparkFun-Passives:JUMPER-3
JP2 JP4 JP5 = SparkFun-Connectors:M06: Header 6 Standard 6-pin 0.1" header. Use with straight break away headers (SKU : PRT-00116), right angle break away headers (PRT-00553), swiss pins (PRT-00743), machine pins (PRT-00117), and female headers (PRT-00115). Molex polarized connector foot print use with SKU : PRT-08094 with associated crimp pins and housings. NOTES ON THE VARIANTS LOCK and LOCK_LONGPADS... This footprint was designed to help hold the alignment of a through-hole component (i.e. 6-pin header) while soldering it into place. You may notice that each hole has been shifted either up or down by 0.005 of an inch from it's more standard position (which is a perfectly straight line). This slight alteration caused the pins (the squares in the middle) to touch the edges of the holes. Because they are alternating, it causes a "brace" to hold the component in place. 0.005 has proven to be the perfect amount of "off-center" position when using our standard breakaway headers. Although looks a little odd when you look at the bare footprint, once you have a header in there, the alteration is very hard to notice. Also,if you push a header all the way into place, it is covered up entirely on the bottom side. This idea of altering the position of holes to aid alignment will be further integrated into the Sparkfun Library for other footprints. It can help hold any component with 3 or more connection pins.
JP3 = SparkFun-Passives:JUMPER-2: Jumper Basic 0.1" spaced jumper. Use with breakaway headers.
JP7 = SparkFun-Connectors:M05X2: Header 5x2 Standard 10-pin dual row 0.1" header. Commonly used with AVR-ISP. Use with Spark Fun Electronics SKU: PRT-00778
LED2-LED4 = led:LED: LED OSRAM: - CHIPLED LG R971, LG N971, LY N971, LG Q971, LY Q971, LO R971, LY R971 LH N974, LH R974 LS Q976, LO Q976, LY Q976 LO Q996 - Hyper CHIPLED LW Q18S LB Q993, LB Q99A, LB R99A - SideLED LS A670, LO A670, LY A670, LG A670, LP A670 LB A673, LV A673, LT A673, LW A673 LH A674 LY A675 LS A676, LA A676, LO A676, LY A676, LW A676 LS A679, LY A679, LG A679 - Hyper Micro SIDELED® LS Y876, LA Y876, LO Y876, LY Y876 LT Y87S - SmartLED LW L88C, LW L88S LB L89C, LB L89S, LG L890 LS L89K, LO L89K, LY L89K LS L896, LA L896, LO L896, LY L896 - TOPLED LS T670, LO T670, LY T670, LG T670, LP T670 LSG T670, LSP T670, LSY T670, LOP T670, LYG T670 LG T671, LOG T671, LSG T671 LB T673, LV T673, LT T673, LW T673 LH T674 LS T676, LA T676, LO T676, LY T676, LB T676, LH T676, LSB T676, LW T676 LB T67C, LV T67C, LT T67C, LS T67K, LO T67K, LY T67K, LW E67C LS E67B, LA E67B, LO E67B, LY E67B, LB E67C, LV E67C, LT E67C LW T67C LS T679, LY T679, LG T679 LS T770, LO T770, LY T770, LG T770, LP T770 LB T773, LV T773, LT T773, LW T773 LH T774 LS E675, LA E675, LY E675, LS T675 LS T776, LA T776, LO T776, LY T776, LB T776 LHGB T686 LT T68C, LB T68C - Hyper Mini TOPLED® LB M676 - Mini TOPLED Santana® LG M470 LS M47K, LO M47K, LY M47K Source: http://www.osram.convergy.de LUXEON: - LUMILED® LXK2-PW12-R00, LXK2-PW12-S00, LXK2-PW14-U00, LXK2-PW14-V00 LXK2-PM12-R00, LXK2-PM12-S00, LXK2-PM14-U00 LXK2-PE12-Q00, LXK2-PE12-R00, LXK2-PE12-S00, LXK2-PE14-T00, LXK2-PE14-U00 LXK2-PB12-K00, LXK2-PB12-L00, LXK2-PB12-M00, LXK2-PB14-N00, LXK2-PB14-P00, LXK2-PB14-Q00 LXK2-PR12-L00, LXK2-PR12-M00, LXK2-PR14-Q00, LXK2-PR14-R00 LXK2-PD12-Q00, LXK2-PD12-R00, LXK2-PD12-S00 LXK2-PH12-R00, LXK2-PH12-S00 LXK2-PL12-P00, LXK2-PL12-Q00, LXK2-PL12-R00 Source: www.luxeon.com KINGBRIGHT: KA-3528ASYC Source: www.kingbright.com
QE1-QE12 = microLib:CON_1.27_8
QERX1-QERX12 = microLib:AM26LV32E
R1-R41 R44-R46 RU1 RU4 RU5 = resistor:R-EU_: RESISTOR, European symbol
R42 R43 R47-R50 = rcl:R-EU_: RESISTOR, European symbol
U1 = microLib:DSPIC33EP512MU814
U2 = microLib:XC3S200A-VQ100
U3 = microLib:SST25VF032B
U4-U23 = microLib:EL3H4-G
U24 = 0SBLib:MCP2551: High-Speed CAN Transceiver
U26 = SparkFun-RF:RN171: WiFi Module
X1 = microLib:XTAL_5X3

## Board
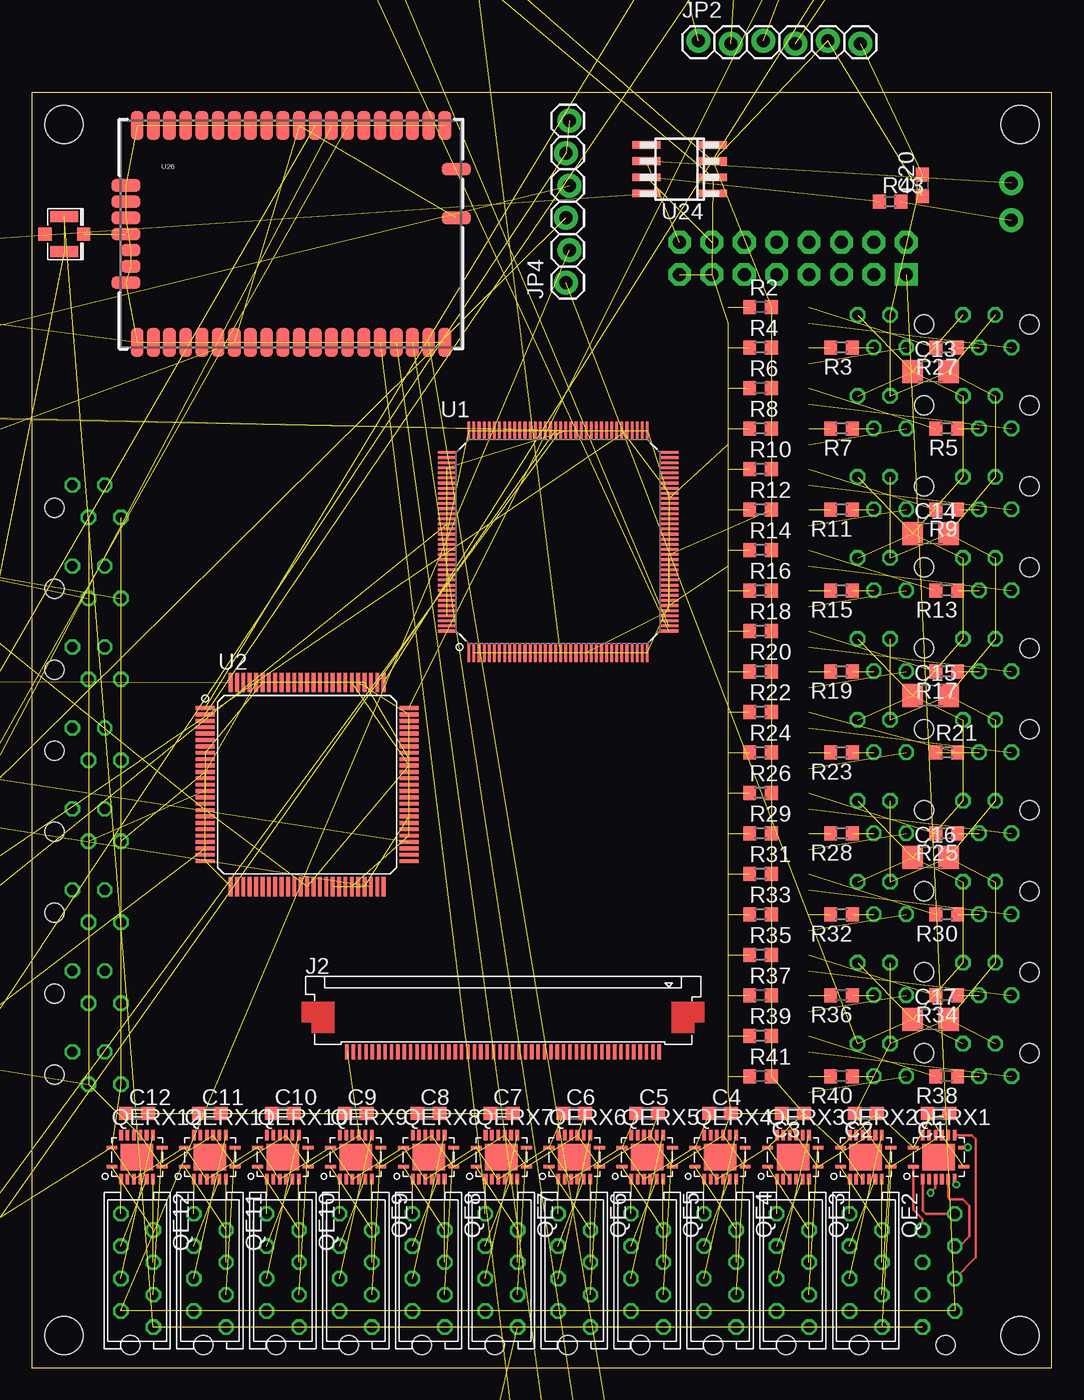
[diagram p7: board, top side]
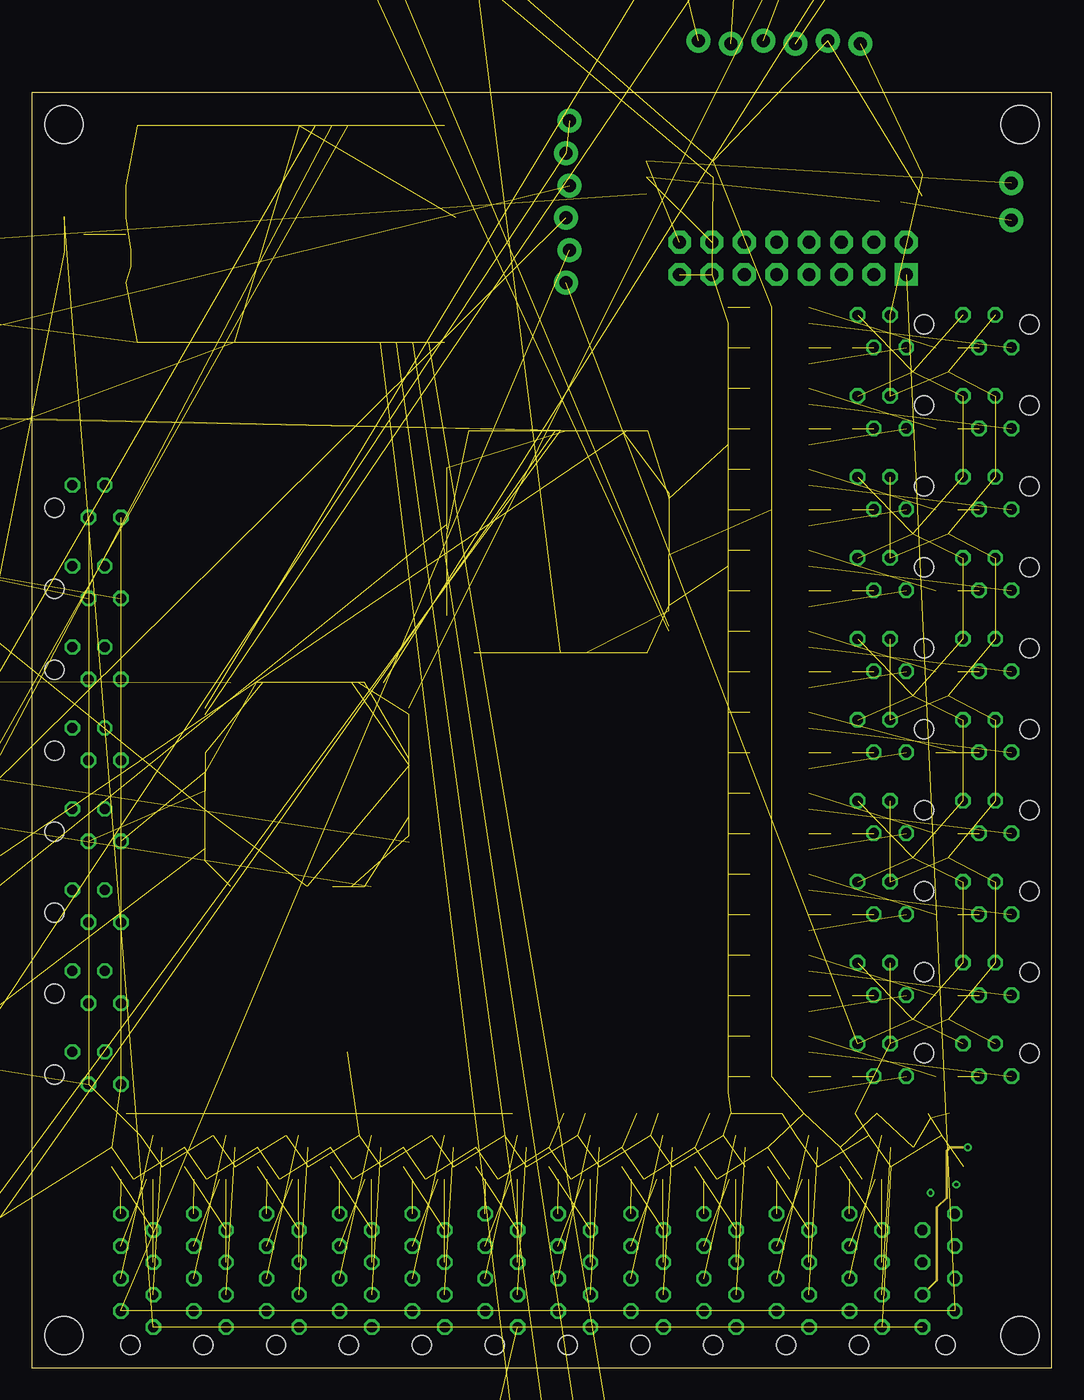
[diagram p8: board, inner layer Route2]
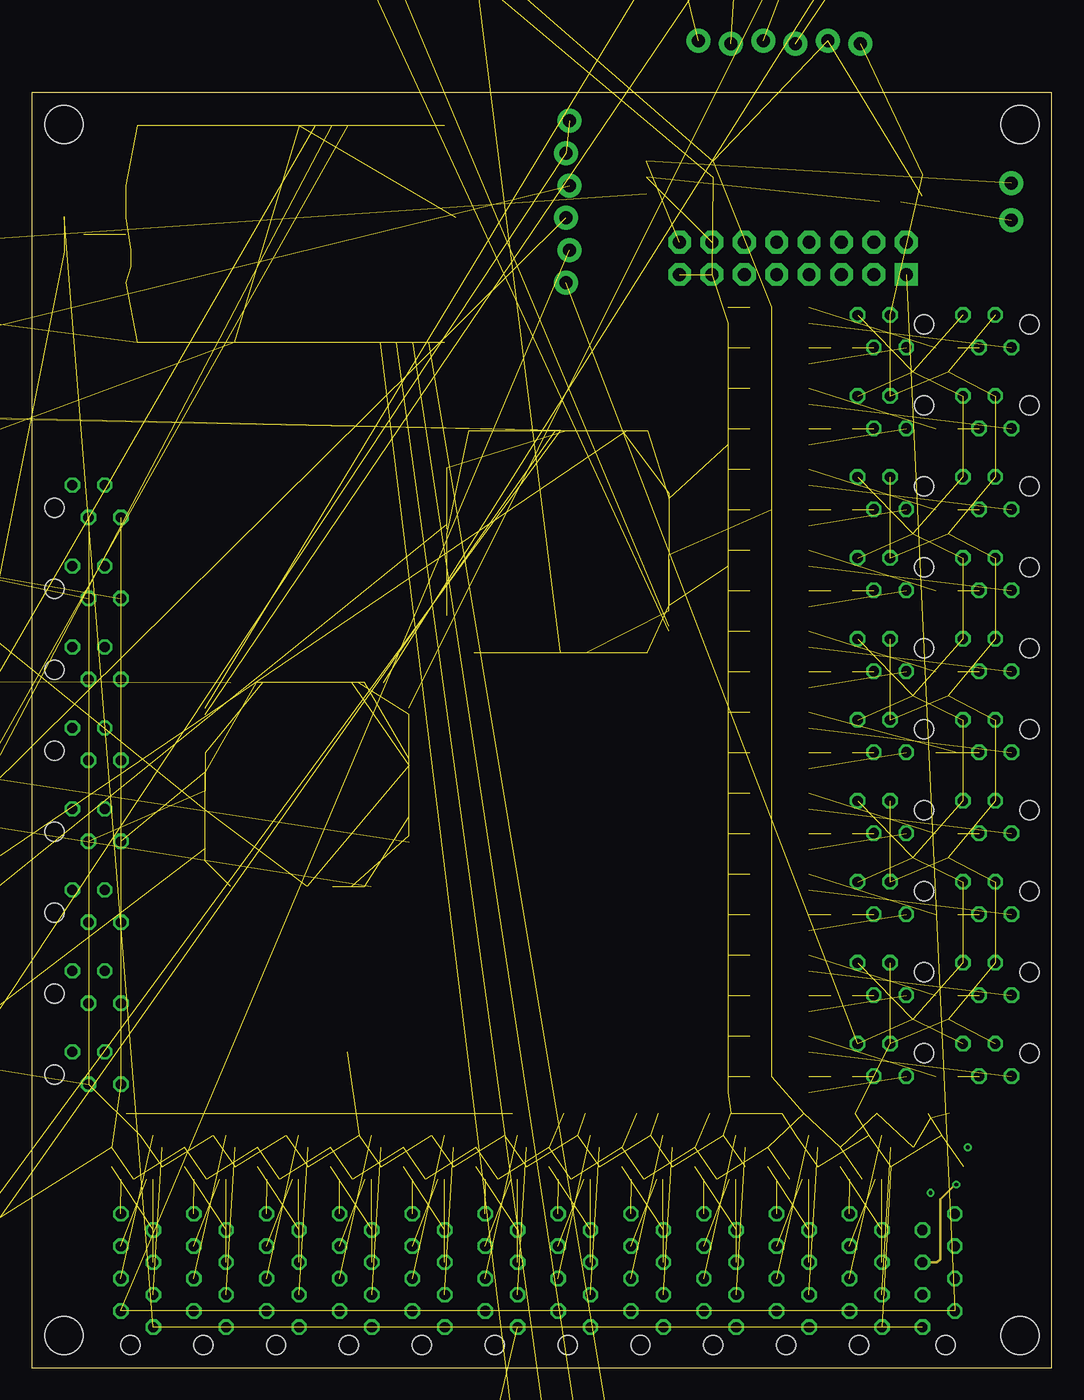
[diagram p9: board, inner layer Route15]
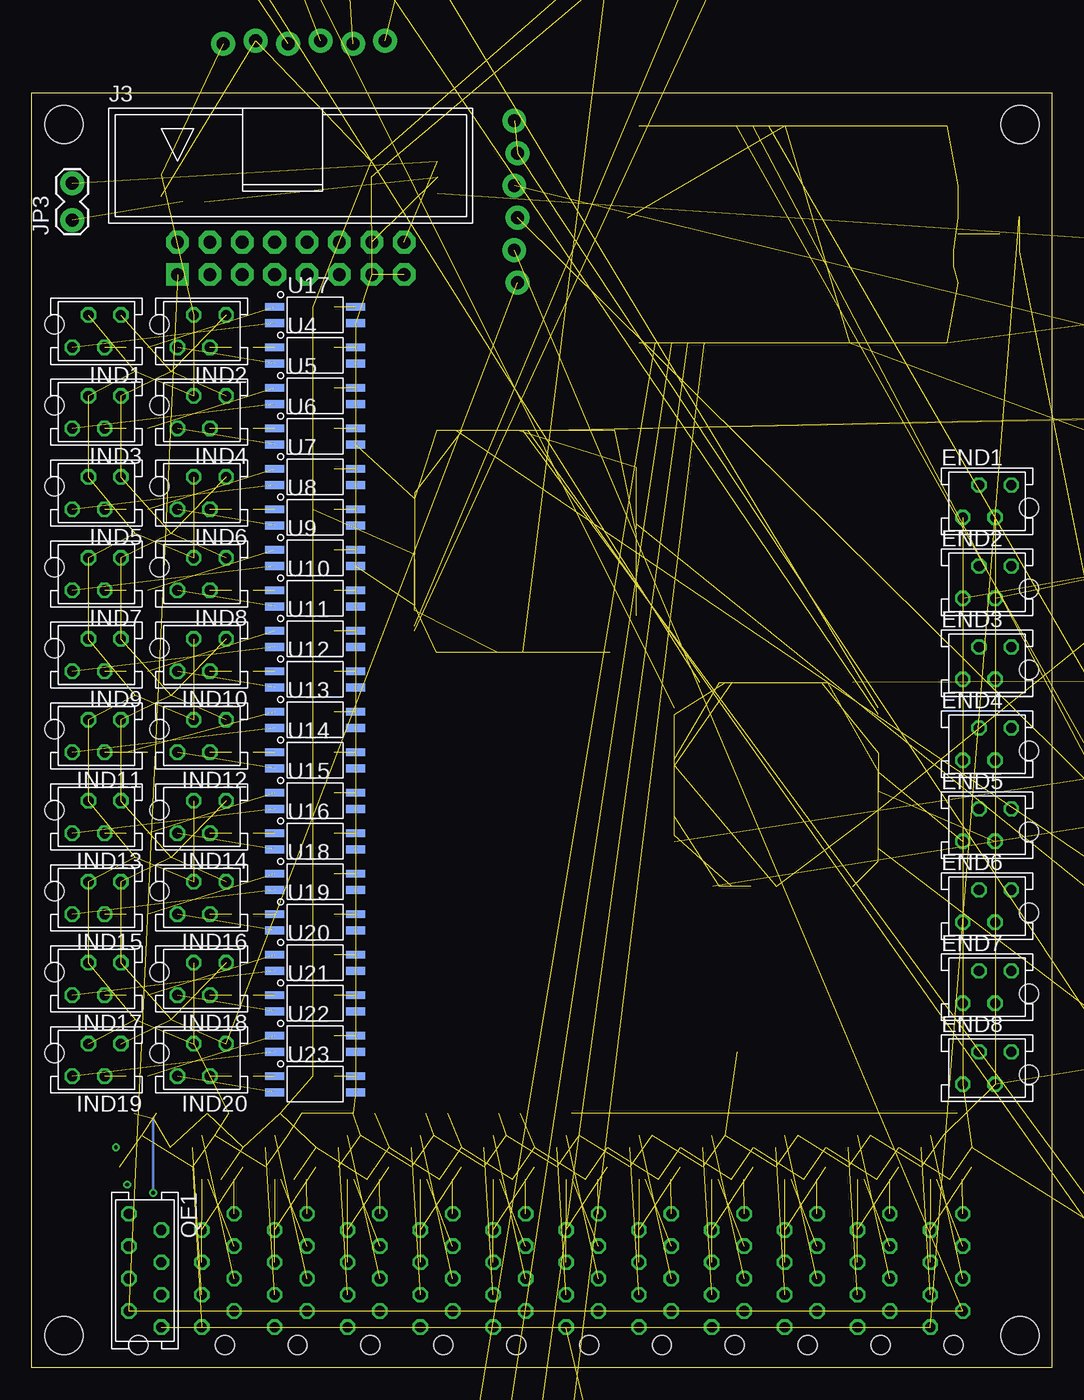
[diagram p10: board, bottom side, seen from below]

Size 80 x 100 mm. Coordinates in mm from the lower left corner, seen from the top.
Outline: 0,0 80,0 80,100 0,100 0,0
Copper layers (1*2*15*16): Top 0.035mm / dielectric 0.2mm / Route2 0.0175mm / dielectric 0.3mm / Route15 0.0175mm / dielectric 0.2mm / Bottom 0.035mm
Design rules: minimum track width 8mil, minimum drill 12mil, track to track 8mil, track to pad 8mil, pad to pad 6mil, via to via 8mil, smd to smd 0mil, copper to edge 10mil, drill to drill 8mil, minimum pad ring 6mil, minimum via ring 4mil, stop-mask expansion 4mil, vias tented up to drill 100mil, thermal gap 10mil
Holes 3 mm at 2.5,2.5 77.5,2.5 77.5,97.5 2.5,97.5

### Footprints (pad centres in the part's own frame; a part is rotated, then mirrored left to right if it is on the bottom)
C0603 = smd 1.1 x 1: 1 -0.85,0; 2 0.85,0
C1206 = smd 1.6 x 1.8: 1 -1.4,0; 2 1.4,0
C1210 = smd 1.6 x 2.7: 1 -1.4,0; 2 1.4,0
CON_1.27_4 = drill 0.8 octagon: 1 -1.905,-1.27; 2 -0.635,1.27; 3 0.635,-1.27; 4 1.905,1.27 | hole 1.5: 3.305,-0.53
FFC-SMD-0.5_50 = smd 0.25 x 1.2: 1 -12.25,0; 2 -11.75,0; 3 -11.25,0; 4 -10.75,0; 5 -10.25,0; 6 -9.75,0; 7 -9.25,0; 8 -8.75,0; 9 -8.25,0; 10 -7.75,0; 11 -7.25,0; 12 -6.75,0; 13 -6.25,0; 14 -5.75,0; 15 -5.25,0; 16 -4.75,0; 17 -4.25,0; 18 -3.75,0; 19 -3.25,0; 20 -2.75,0; 21 -2.25,0; 22 -1.75,0; 23 -1.25,0; 24 -0.75,0; 25 -0.25,0; 26 0.25,0; 27 0.75,0; 28 1.25,0; 29 1.75,0; 30 2.25,0; 31 2.75,0; 32 3.25,0; 33 3.75,0; 34 4.25,0; 35 4.75,0; 36 5.25,0; 37 5.75,0; 38 6.25,0; 39 6.75,0; 40 7.25,0; 41 7.75,0; 42 8.25,0; 43 8.75,0; 44 9.25,0; 45 9.75,0; 46 10.25,0; 47 10.75,0; 48 11.25,0; 49 11.75,0; 50 12.25,0
CON_2X_2.54_H_16 = drill 1 pad 1.778 square: 1 8.89,2.54 | drill 1 pad 1.778 octagon: 2 8.89,0; 3 6.35,2.54; 4 6.35,0; 5 3.81,2.54; 6 3.81,0; 7 1.27,2.54; 8 1.27,0; 9 -1.27,2.54; 10 -1.27,0; 11 -3.81,2.54; 12 -3.81,0; 13 -6.35,2.54; 14 -6.35,0; 15 -8.89,2.54; 16 -8.89,0
U.FL = smd 2.2 x 0.85: P$1 0,1.375; P$2 0,-1.375 | smd 1.05 x 1: P$3 1.525,0; P$4 -1.525,0
1X05_LOCK = drill 1.016 pad 1.88: 1 0,0.127; 2 2.54,-0.127; 3 5.08,0.127; 4 7.62,-0.127; 5 10.16,0.127
1X03 = drill 1.016 pad 1.88: 1 0,0; 2 2.54,0; 3 5.08,0
1X06_LOCK = drill 1.016 pad 1.88: 1 0,0; 2 2.54,-0.254; 3 5.08,0; 4 7.62,-0.254; 5 10.16,0; 6 12.7,-0.254
1X02_LOCK = drill 1.016 pad 1.88: 1 -0.178,0; 2 2.718,0
1X06-1MM = smd 0.6 x 1.55: 1 -2.54,1.27; 2 -1.54,1.27; 3 -0.54,1.27; 4 0.46,1.27; 5 1.46,1.27; 6 2.46,1.27 | smd 1.2 x 1.8: P$1 -3.84,-0.955; P$2 3.76,-0.955
AVR_ICSP = drill 1.016 pad 1.88 octagon: 1 -1.27,5.08; 2 1.27,5.08; 3 -1.27,2.54; 4 1.27,2.54; 5 -1.27,0; 6 1.27,0; 7 -1.27,-2.54; 8 1.27,-2.54; 9 -1.27,-5.08; 10 1.27,-5.08
CHIP-LED0805 = smd 1.2 x 1.2: A 0,-1.05; C 0,1.05
CON_1.27_8 = drill 0.8 octagon: 1 -4.445,-1.27; 2 -3.175,1.27; 3 -1.905,-1.27; 4 -0.635,1.27; 5 0.635,-1.27; 6 1.905,1.27; 7 3.175,-1.27; 8 4.445,1.27 | hole 1.5: 5.845,-0.53
RGY_16 = smd 0.85 x 0.28: 1 -1.975,-0.75; 8 1.975,-0.75; 9 1.975,0.75; 16 -1.975,0.75 | smd 0.28 x 0.85: 2 -1.25,-1.725; 3 -0.75,-1.725; 4 -0.25,-1.725; 5 0.25,-1.725; 6 0.75,-1.725; 7 1.25,-1.725; 10 1.25,1.725; 11 0.75,1.725; 12 0.25,1.725; 13 -0.25,1.725; 14 -0.75,1.725; 15 -1.25,1.725 | smd 2.55 x 2.05: TPAD 0,0
R0603 = smd 1 x 1.1: 1 -0.85,0; 2 0.85,0
TQFP_144 = smd 0.203 x 1.45: 1 -7,-8.7; 2 -6.6,-8.7; 3 -6.2,-8.7; 4 -5.8,-8.7; 5 -5.4,-8.7; 6 -5,-8.7; 7 -4.6,-8.7; 8 -4.2,-8.7; 9 -3.8,-8.7; 10 -3.4,-8.7; 11 -3,-8.7; 12 -2.6,-8.7; 13 -2.2,-8.7; 14 -1.8,-8.7; 15 -1.4,-8.7; 16 -1,-8.7; 17 -0.6,-8.7; 18 -0.2,-8.7; 19 0.2,-8.7; 20 0.6,-8.7; 21 1,-8.7; 22 1.4,-8.7; 23 1.8,-8.7; 24 2.2,-8.7; 25 2.6,-8.7; 26 3,-8.7; 27 3.4,-8.7; 28 3.8,-8.7; 29 4.2,-8.7; 30 4.6,-8.7; 31 5,-8.7; 32 5.4,-8.7; 33 5.8,-8.7; 34 6.2,-8.7; 35 6.6,-8.7; 36 7,-8.7; 73 7,8.7; 74 6.6,8.7; 75 6.2,8.7; 76 5.8,8.7; 77 5.4,8.7; 78 5,8.7; 79 4.6,8.7; 80 4.2,8.7; 81 3.8,8.7; 82 3.4,8.7; 83 3,8.7; 84 2.6,8.7; 85 2.2,8.7; 86 1.8,8.7; 87 1.4,8.7; 88 1,8.7; 89 0.6,8.7; 90 0.2,8.7; 91 -0.2,8.7; 92 -0.6,8.7; 93 -1,8.7; 94 -1.4,8.7; 95 -1.8,8.7; 96 -2.2,8.7; 97 -2.6,8.7; 98 -3,8.7; 99 -3.4,8.7; 100 -3.8,8.7; 101 -4.2,8.7; 102 -4.6,8.7; 103 -5,8.7; 104 -5.4,8.7; 105 -5.8,8.7; 106 -6.2,8.7; 107 -6.6,8.7; 108 -7,8.7 | smd 1.45 x 0.203: 37 8.7,-7; 38 8.7,-6.6; 39 8.7,-6.2; 40 8.7,-5.8; 41 8.7,-5.4; 42 8.7,-5; 43 8.7,-4.6; 44 8.7,-4.2; 45 8.7,-3.8; 46 8.7,-3.4; 47 8.7,-3; 48 8.7,-2.6; 49 8.7,-2.2; 50 8.7,-1.8; 51 8.7,-1.4; 52 8.7,-1; 53 8.7,-0.6; 54 8.7,-0.2; 55 8.7,0.2; 56 8.7,0.6; 57 8.7,1; 58 8.7,1.4; 59 8.7,1.8; 60 8.7,2.2; 61 8.7,2.6; 62 8.7,3; 63 8.7,3.4; 64 8.7,3.8; 65 8.7,4.2; 66 8.7,4.6; 67 8.7,5; 68 8.7,5.4; 69 8.7,5.8; 70 8.7,6.2; 71 8.7,6.6; 72 8.7,7; 109 -8.7,7; 110 -8.7,6.6; 111 -8.7,6.2; 112 -8.7,5.8; 113 -8.7,5.4; 114 -8.7,5; 115 -8.7,4.6; 116 -8.7,4.2; 117 -8.7,3.8; 118 -8.7,3.4; 119 -8.7,3; 120 -8.7,2.6; 121 -8.7,2.2; 122 -8.7,1.8; 123 -8.7,1.4; 124 -8.7,1; 125 -8.7,0.6; 126 -8.7,0.2; 127 -8.7,-0.2; 128 -8.7,-0.6; 129 -8.7,-1; 130 -8.7,-1.4; 131 -8.7,-1.8; 132 -8.7,-2.2; 133 -8.7,-2.6; 134 -8.7,-3; 135 -8.7,-3.4; 136 -8.7,-3.8; 137 -8.7,-4.2; 138 -8.7,-4.6; 139 -8.7,-5; 140 -8.7,-5.4; 141 -8.7,-5.8; 142 -8.7,-6.2; 143 -8.7,-6.6; 144 -8.7,-7
VQFP_100 = smd 1.5 x 0.3: 1 -8,6; 2 -8,5.5; 3 -8,5; 4 -8,4.5; 5 -8,4; 6 -8,3.5; 7 -8,3; 8 -8,2.5; 9 -8,2; 10 -8,1.5; 11 -8,1; 12 -8,0.5; 13 -8,0; 14 -8,-0.5; 15 -8,-1; 16 -8,-1.5; 17 -8,-2; 18 -8,-2.5; 19 -8,-3; 20 -8,-3.5; 21 -8,-4; 22 -8,-4.5; 23 -8,-5; 24 -8,-5.5; 25 -8,-6; 51 8,-6; 52 8,-5.5; 53 8,-5; 54 8,-4.5; 55 8,-4; 56 8,-3.5; 57 8,-3; 58 8,-2.5; 59 8,-2; 60 8,-1.5; 61 8,-1; 62 8,-0.5; 63 8,0; 64 8,0.5; 65 8,1; 66 8,1.5; 67 8,2; 68 8,2.5; 69 8,3; 70 8,3.5; 71 8,4; 72 8,4.5; 73 8,5; 74 8,5.5; 75 8,6 | smd 0.3 x 1.5: 26 -6,-8; 27 -5.5,-8; 28 -5,-8; 29 -4.5,-8; 30 -4,-8; 31 -3.5,-8; 32 -3,-8; 33 -2.5,-8; 34 -2,-8; 35 -1.5,-8; 36 -1,-8; 37 -0.5,-8; 38 0,-8; 39 0.5,-8; 40 1,-8; 41 1.5,-8; 42 2,-8; 43 2.5,-8; 44 3,-8; 45 3.5,-8; 46 4,-8; 47 4.5,-8; 48 5,-8; 49 5.5,-8; 50 6,-8; 76 6,8; 77 5.5,8; 78 5,8; 79 4.5,8; 80 4,8; 81 3.5,8; 82 3,8; 83 2.5,8; 84 2,8; 85 1.5,8; 86 1,8; 87 0.5,8; 88 0,8; 89 -0.5,8; 90 -1,8; 91 -1.5,8; 92 -2,8; 93 -2.5,8; 94 -3,8; 95 -3.5,8; 96 -4,8; 97 -4.5,8; 98 -5,8; 99 -5.5,8; 100 -6,8
SOIC_8 = smd 0.65 x 2: 1 -1.905,-3.8; 2 -0.635,-3.8; 3 0.635,-3.8; 4 1.905,-3.8; 5 1.905,3.8; 6 0.635,3.8; 7 -0.635,3.8; 8 -1.905,3.8
SSOP_4 = smd 1.5 x 0.6: 1 -3.175,0.635; 2 -3.175,-0.635; 3 3.175,-0.635; 4 3.175,0.635
SO-08 = smd 0.6 x 2.2: 1 -1.905,-2.6; 2 -0.635,-2.6; 3 0.635,-2.6; 4 1.905,-2.6; 5 1.905,2.6; 6 0.635,2.6; 7 -0.635,2.6; 8 -1.905,2.6
RN171 = smd 1.016 x 2.286: 1 12.065,8.509; 2 10.795,8.509; 3 9.525,8.509; 4 8.255,8.509; 5 6.985,8.509; 6 5.715,8.509; 7 4.445,8.509; 8 3.175,8.509; 9 1.905,8.509; 10 0.635,8.509; 11 -0.635,8.509; 12 -1.905,8.509; 13 -3.175,8.509; 14 -4.445,8.509; 15 -5.715,8.509; 16 -6.985,8.509; 17 -8.255,8.509; 18 -9.525,8.509; 19 -10.795,8.509; 20 -12.065,8.509; 28 -12.065,-8.509; 29 -10.795,-8.509; 30 -9.525,-8.509; 31 -8.255,-8.509; 32 -6.985,-8.509; 33 -5.715,-8.509; 34 -4.445,-8.509; 35 -3.175,-8.509; 36 -1.905,-8.509; 37 -0.635,-8.509; 38 0.635,-8.509; 39 1.905,-8.509; 40 3.175,-8.509; 41 4.445,-8.509; 42 5.715,-8.509; 43 6.985,-8.509; 44 8.255,-8.509; 45 9.525,-8.509; 46 10.795,-8.509; 47 12.065,-8.509 | smd 2.286 x 1.016: 21 -12.954,3.81; 22 -12.954,2.54; 23 -12.954,1.27; 24 -12.954,0; 27 -12.954,-3.81; 48 12.954,5.08; 49 12.954,1.27 | smd 1.524 x 1.016: 25 -12.573,-1.27; 26 -12.573,-2.54
CRYSTAL-OSC-SMD-5X3 = smd 1.9 x 1.1: 1 -1.85,-1.15; 2 1.85,-1.15; 3 1.85,1.15; 4 -1.85,1.15

### Placement (x,y rotation side)
C1  71.12,19.94 180 top
C2  65.41,19.94 180 top
C3  59.69,19.94 180 top
C4  53.98,19.94 0 top
C5  48.26,19.94 0 top
C6  42.55,19.94 0 top
C7  36.83,19.94 0 top
C8  31.11,19.94 0 top
C9  25.4,19.94 0 top
C10  19.68,19.94 0 top
C11  13.97,19.94 0 top
C12  8.26,19.94 0 top
C13  70.48,78.11 0 top
C14  70.48,65.41 0 top
C15  70.48,52.7 0 top
C16  70.48,40.01 0 top
C17  70.48,27.3 0 top
C20  69.85,92.71 90 top
CB1  -50.8,53.34 0 top  (outside the outline)
CB2  -58.42,53.34 0 top  (outside the outline)
CB3  -66.04,53.34 0 top  (outside the outline)
CB4  -73.66,53.34 0 top  (outside the outline)
CB5  -17.78,59.69 0 top  (outside the outline)
CB6  -25.4,59.69 0 top  (outside the outline)
CB7  -33.02,59.69 0 top  (outside the outline)
CB8  -40.64,59.69 0 top  (outside the outline)
CB9  -48.26,59.69 0 top  (outside the outline)
CB10  -55.88,59.69 0 top  (outside the outline)
CB11  -63.5,59.69 0 top  (outside the outline)
CB12  -71.12,59.69 0 top  (outside the outline)
CB13  -17.78,64.77 0 top  (outside the outline)
CB14  -25.4,64.77 0 top  (outside the outline)
CB15  -33.02,64.77 0 top  (outside the outline)
CB16  -40.64,64.77 0 top  (outside the outline)
CB17  -48.26,64.77 0 top  (outside the outline)
CB18  -55.88,64.77 0 top  (outside the outline)
CB19  -63.5,64.77 0 top  (outside the outline)
CB20  -71.12,64.77 0 top  (outside the outline)
CB21  -17.78,69.85 0 top  (outside the outline)
CB22  -25.4,69.85 0 top  (outside the outline)
CC1  -16.51,25.4 0 top  (outside the outline)
CT1  -22.86,25.4 0 top  (outside the outline)
CX1  -24.13,74.93 0 top  (outside the outline)
CX2  -30.48,74.93 0 top  (outside the outline)
END1  5.08,67.94 0 bottom
END2  5.08,61.59 0 bottom
END3  5.08,55.24 0 bottom
END4  5.08,48.9 0 bottom
END5  5.08,42.55 0 bottom
END6  5.08,36.2 0 bottom
END7  5.08,29.84 0 bottom
END8  5.08,23.5 0 bottom
IND1  74.93,81.28 180 bottom
IND2  66.67,81.28 180 bottom
IND3  74.93,74.93 180 bottom
IND4  66.67,74.93 180 bottom
IND5  74.93,68.58 180 bottom
IND6  66.67,68.58 180 bottom
IND7  74.93,62.23 180 bottom
IND8  66.67,62.23 180 bottom
IND9  74.93,55.88 180 bottom
IND10  66.67,55.88 180 bottom
IND11  74.93,49.53 180 bottom
IND12  66.67,49.53 180 bottom
IND13  74.93,43.18 180 bottom
IND14  66.67,43.18 180 bottom
IND15  74.93,36.83 180 bottom
IND16  66.67,36.83 180 bottom
IND17  74.93,30.48 180 bottom
IND18  66.67,30.48 180 bottom
IND19  74.93,24.13 180 bottom
IND20  66.67,24.13 180 bottom
J2  36.96,24.77 180 top
J3  59.69,88.27 180 bottom
J4  2.54,88.9 0 top
J44  34.29,113.67 0 bottom  (outside the outline)
JP1  -72.39,-22.86 0 top  (outside the outline)
JP2  52.28,104.07 0 top  (outside the outline)
JP3  76.83,90.17 90 bottom
JP4  41.91,85.09 90 top
JP5  87.63,86.36 270 top  (outside the outline)
JP7  40.64,-8.89 270 top  (outside the outline)
LED2  -78.74,-76.2 0 top  (outside the outline)
LED3  -73.66,-76.2 0 top  (outside the outline)
LED4  -68.58,-76.2 0 top  (outside the outline)
QE1  71.12,7.62 270 bottom
QE2  65.41,7.62 270 top
QE3  59.69,7.62 270 top
QE4  53.98,7.62 270 top
QE5  48.26,7.62 270 top
QE6  42.55,7.62 270 top
QE7  36.83,7.62 270 top
QE8  31.11,7.62 270 top
QE9  25.4,7.62 270 top
QE10  19.68,7.62 270 top
QE11  13.97,7.62 270 top
QE12  8.26,7.62 270 top
QERX1  71.12,16.51 0 top
QERX2  65.41,16.51 0 top
QERX3  59.69,16.51 0 top
QERX4  53.98,16.51 0 top
QERX5  48.26,16.51 0 top
QERX6  42.55,16.51 0 top
QERX7  36.83,16.51 0 top
QERX8  31.11,16.51 0 top
QERX9  25.4,16.51 0 top
QERX10  19.68,16.51 0 top
QERX11  13.97,16.51 0 top
QERX12  8.26,16.51 0 top
R1  -29.21,-16.51 0 top  (outside the outline)
R2  57.15,83.19 0 top
R3  63.5,80.01 180 top
R4  57.15,80.01 0 top
R5  71.75,73.66 180 top
R6  57.15,76.83 0 top
R7  63.5,73.66 180 top
R8  57.15,73.66 0 top
R9  71.75,67.31 180 top
R10  57.15,70.48 0 top
R11  63.5,67.31 180 top
R12  57.15,67.31 0 top
R13  71.75,60.96 180 top
R14  57.15,64.14 0 top
R15  63.5,60.96 180 top
R16  57.15,60.96 0 top
R17  71.75,54.61 180 top
R18  57.15,57.78 0 top
R19  63.5,54.61 180 top
R20  57.15,54.61 0 top
R21  71.75,48.26 0 top
R22  57.15,51.44 0 top
R23  63.5,48.26 180 top
R24  57.15,48.26 0 top
R25  71.75,41.91 180 top
R26  57.15,45.09 0 top
R27  71.75,80.01 180 top
R28  63.5,41.91 180 top
R29  57.15,41.91 0 top
R30  71.75,35.56 180 top
R31  57.15,38.73 0 top
R32  63.5,35.56 180 top
R33  57.15,35.56 0 top
R34  71.75,29.21 180 top
R35  57.15,32.38 0 top
R36  63.5,29.21 180 top
R37  57.15,29.21 0 top
R38  71.75,22.86 180 top
R39  57.15,26.04 0 top
R40  63.5,22.86 180 top
R41  57.15,22.86 0 top
R42  -36.2,86.36 0 top  (outside the outline)
R43  67.31,91.44 0 top
R44  -76.2,-81.28 0 top  (outside the outline)
R45  -71.12,-81.28 0 top  (outside the outline)
R46  -80.01,-87.63 0 top  (outside the outline)
R47  50.54,111.97 90 top  (outside the outline)
R48  55.29,111.97 90 top  (outside the outline)
R49  60.04,111.97 90 top  (outside the outline)
R50  64.79,111.97 90 top  (outside the outline)
RU1  -34.92,47.62 0 top  (outside the outline)
RU4  -36.2,51.44 0 top  (outside the outline)
RU5  -38.1,53.98 0 top  (outside the outline)
U1  41.27,64.77 0 top
U2  21.59,45.72 0 top
U3  -26.67,-7.62 0 top  (outside the outline)
U4  57.78,79.38 0 bottom
U5  57.78,76.2 0 bottom
U6  57.78,73.03 0 bottom
U7  57.78,69.85 0 bottom
U8  57.78,66.67 0 bottom
U9  57.78,63.5 0 bottom
U10  57.78,60.33 0 bottom
U11  57.78,57.15 0 bottom
U12  57.78,53.98 0 bottom
U13  57.78,50.8 0 bottom
U14  57.78,47.62 0 bottom
U15  57.78,44.45 0 bottom
U16  57.78,41.27 0 bottom
U17  57.78,82.55 0 bottom
U18  57.78,38.1 0 bottom
U19  57.78,34.92 0 bottom
U20  57.78,31.75 0 bottom
U21  57.78,28.57 0 bottom
U22  57.78,25.4 0 bottom
U23  57.78,22.23 0 bottom
U24  50.8,93.98 90 top
U26  20.32,88.9 0 top
X1  -19.05,-10.16 0 top  (outside the outline)

### Tracks (layer width: path | path; a pad name or v marks a point on that pad's centre or on a via)
+1V2L  (8 unrouted)
+3V3L  (via drill 0.3 pad 0.61)  (109 unrouted)
  Top 0.203: QERX1.4 70.87,14.1 v70.48,13.72
  Bottom 0.203: v70.48,13.72 70.48,19.56
+3V3L1  (5 unrouted)
+5VL  (13 unrouted)
+12VL  (25 unrouted)
CANH  (2 unrouted)
CANL  (2 unrouted)
CONF_!JTAG!  (1 unrouted)
CONF_DONE  (1 unrouted)
CONF_INIT_B  (1 unrouted)
CONF_PROG_B  (1 unrouted)
GND  (177 unrouted)
GND1  (5 unrouted)
ICSP_!MCLR!  (1 unrouted)
ICSP_PGC  (1 unrouted)
ICSP_PGD  (1 unrouted)
IND_1  (1 unrouted)
IND_2  (1 unrouted)
IND_3  (1 unrouted)
IND_4  (1 unrouted)
IND_5  (1 unrouted)
IND_6  (1 unrouted)
IND_7  (1 unrouted)
IND_8  (1 unrouted)
IND_9  (1 unrouted)
IND_10  (1 unrouted)
IND_11  (1 unrouted)
IND_12  (1 unrouted)
IND_13  (1 unrouted)
IND_14  (1 unrouted)
IND_15  (1 unrouted)
IND_16  (1 unrouted)
IND_17  (1 unrouted)
IND_18  (1 unrouted)
IND_19  (1 unrouted)
IND_20  (1 unrouted)
JTAG_TCK  (1 unrouted)
JTAG_TDI  (1 unrouted)
JTAG_TDO  (1 unrouted)
JTAG_TMS  (1 unrouted)
N$1  (via drill 0.3 pad 0.61)
  Top 0.203: QERX1.7 72.37,14.75 72.39,14.35 v72.52,14.35
  Route15 0.203: QE1.4 70.99,8.26 71.25,8.51 71.25,13.21 72.39,14.35 v72.52,14.35
N$2  (1 unrouted)
N$3
  Top 0.203: QE1.3 72.77,9.53 73.53,10.29 73.53,12.7 73.03,13.21 72.01,13.21 71.87,13.35 QERX1.6
N$4
  Top 0.203: QERX1.10 73.71,18.23 74.04,17.91 74.04,8.64 QE1.5
N$5  (via drill 0.3 pad 0.61)
  Top 0.203: QERX1.9 73.39,17.26 v73.41,17.27
  Route2 0.203: v73.41,17.27 72.01,17.27 71.75,17.02 71.75,13.34 70.99,12.57 70.99,6.86 QE1.6
N$6
  Top 0.203: QERX1.1 69.14,12.39 69.85,11.68 QE1.2
N$7
  Top 0.203: QERX1.2 69.87,12.3 70.1,12.06 QE1.1
N$8  (1 unrouted)
N$9  (1 unrouted)
N$10  (1 unrouted)
N$11  (1 unrouted)
N$12  (1 unrouted)
N$13  (1 unrouted)
N$14  (1 unrouted)
N$15  (1 unrouted)
N$16  (1 unrouted)
N$17  (1 unrouted)
N$18  (1 unrouted)
N$19  (1 unrouted)
N$20  (1 unrouted)
N$21  (1 unrouted)
N$22  (1 unrouted)
N$23  (1 unrouted)
N$24  (1 unrouted)
N$25  (1 unrouted)
N$26  (1 unrouted)
N$27  (1 unrouted)
N$28  (1 unrouted)
N$29  (1 unrouted)
N$30  (1 unrouted)
N$31  (1 unrouted)
N$32  (1 unrouted)
N$33  (1 unrouted)
N$34  (1 unrouted)
N$35  (1 unrouted)
N$36  (1 unrouted)
N$37  (1 unrouted)
N$38  (1 unrouted)
N$39  (1 unrouted)
N$40  (1 unrouted)
N$41  (1 unrouted)
N$42  (1 unrouted)
N$43  (1 unrouted)
N$44  (1 unrouted)
N$45  (1 unrouted)
N$46  (1 unrouted)
N$47  (1 unrouted)
N$48  (1 unrouted)
N$49  (1 unrouted)
N$50  (1 unrouted)
N$51  (1 unrouted)
N$52  (1 unrouted)
N$53  (1 unrouted)
N$54  (1 unrouted)
N$55  (1 unrouted)
N$56  (1 unrouted)
N$57  (1 unrouted)
N$58  (1 unrouted)
N$59  (1 unrouted)
N$60  (1 unrouted)
N$61  (1 unrouted)
N$62  (1 unrouted)
N$63  (1 unrouted)
N$64  (1 unrouted)
N$65  (1 unrouted)
N$66  (1 unrouted)
N$67  (1 unrouted)
N$68  (1 unrouted)
N$69  (1 unrouted)
N$70  (1 unrouted)
N$71  (1 unrouted)
N$72  (1 unrouted)
N$73  (1 unrouted)
N$74  (1 unrouted)
N$75  (1 unrouted)
N$76  (1 unrouted)
N$77  (1 unrouted)
N$78  (1 unrouted)
N$79  (1 unrouted)
N$80  (1 unrouted)
N$81  (1 unrouted)
N$82  (1 unrouted)
N$83  (1 unrouted)
N$84  (1 unrouted)
N$85  (1 unrouted)
N$86  (1 unrouted)
N$87  (1 unrouted)
N$88  (1 unrouted)
N$89  (1 unrouted)
N$90  (1 unrouted)
N$91  (1 unrouted)
N$92  (1 unrouted)
N$93  (1 unrouted)
N$94  (1 unrouted)
N$95  (1 unrouted)
N$96  (1 unrouted)
N$97  (1 unrouted)
N$98  (1 unrouted)
N$99  (1 unrouted)
N$100  (1 unrouted)
N$101  (1 unrouted)
N$102  (1 unrouted)
N$103  (1 unrouted)
N$104  (1 unrouted)
N$105  (1 unrouted)
N$106  (1 unrouted)
N$107  (1 unrouted)
N$108  (1 unrouted)
N$109  (1 unrouted)
N$110  (1 unrouted)
N$111  (1 unrouted)
N$112  (1 unrouted)
N$113  (1 unrouted)
N$114  (1 unrouted)
N$115  (1 unrouted)
N$116  (1 unrouted)
N$117  (1 unrouted)
N$118  (1 unrouted)
N$119  (1 unrouted)
N$120  (1 unrouted)
N$121  (1 unrouted)
N$122  (1 unrouted)
N$123  (1 unrouted)
N$124  (1 unrouted)
N$125  (1 unrouted)
N$126  (1 unrouted)
N$127  (1 unrouted)
N$128  (1 unrouted)
N$129  (1 unrouted)
N$130  (1 unrouted)
N$131  (1 unrouted)
N$132  (1 unrouted)
N$133  (1 unrouted)
N$134  (1 unrouted)
N$135  (1 unrouted)
N$136  (1 unrouted)
N$137  (1 unrouted)
N$138  (1 unrouted)
N$139  (1 unrouted)
N$140  (1 unrouted)
N$141  (1 unrouted)
N$142  (1 unrouted)
N$143  (1 unrouted)
OSC1  (2 unrouted)
OSC2  (2 unrouted)
USB_VBUS  (2 unrouted)
VCAP  (1 unrouted)
WIFI_AP  (1 unrouted)
WIFI_CONN  (1 unrouted)
WIFI_CTS  (1 unrouted)
WIFI_RTS  (1 unrouted)
WIFI_RX  (1 unrouted)
WIFI_TX  (1 unrouted)
WIFI_TX_RX  (1 unrouted)